# EAGLE design myStravaB_V3 (EAGLE 9.6.2)

## Sheet 1 of 5: MCU
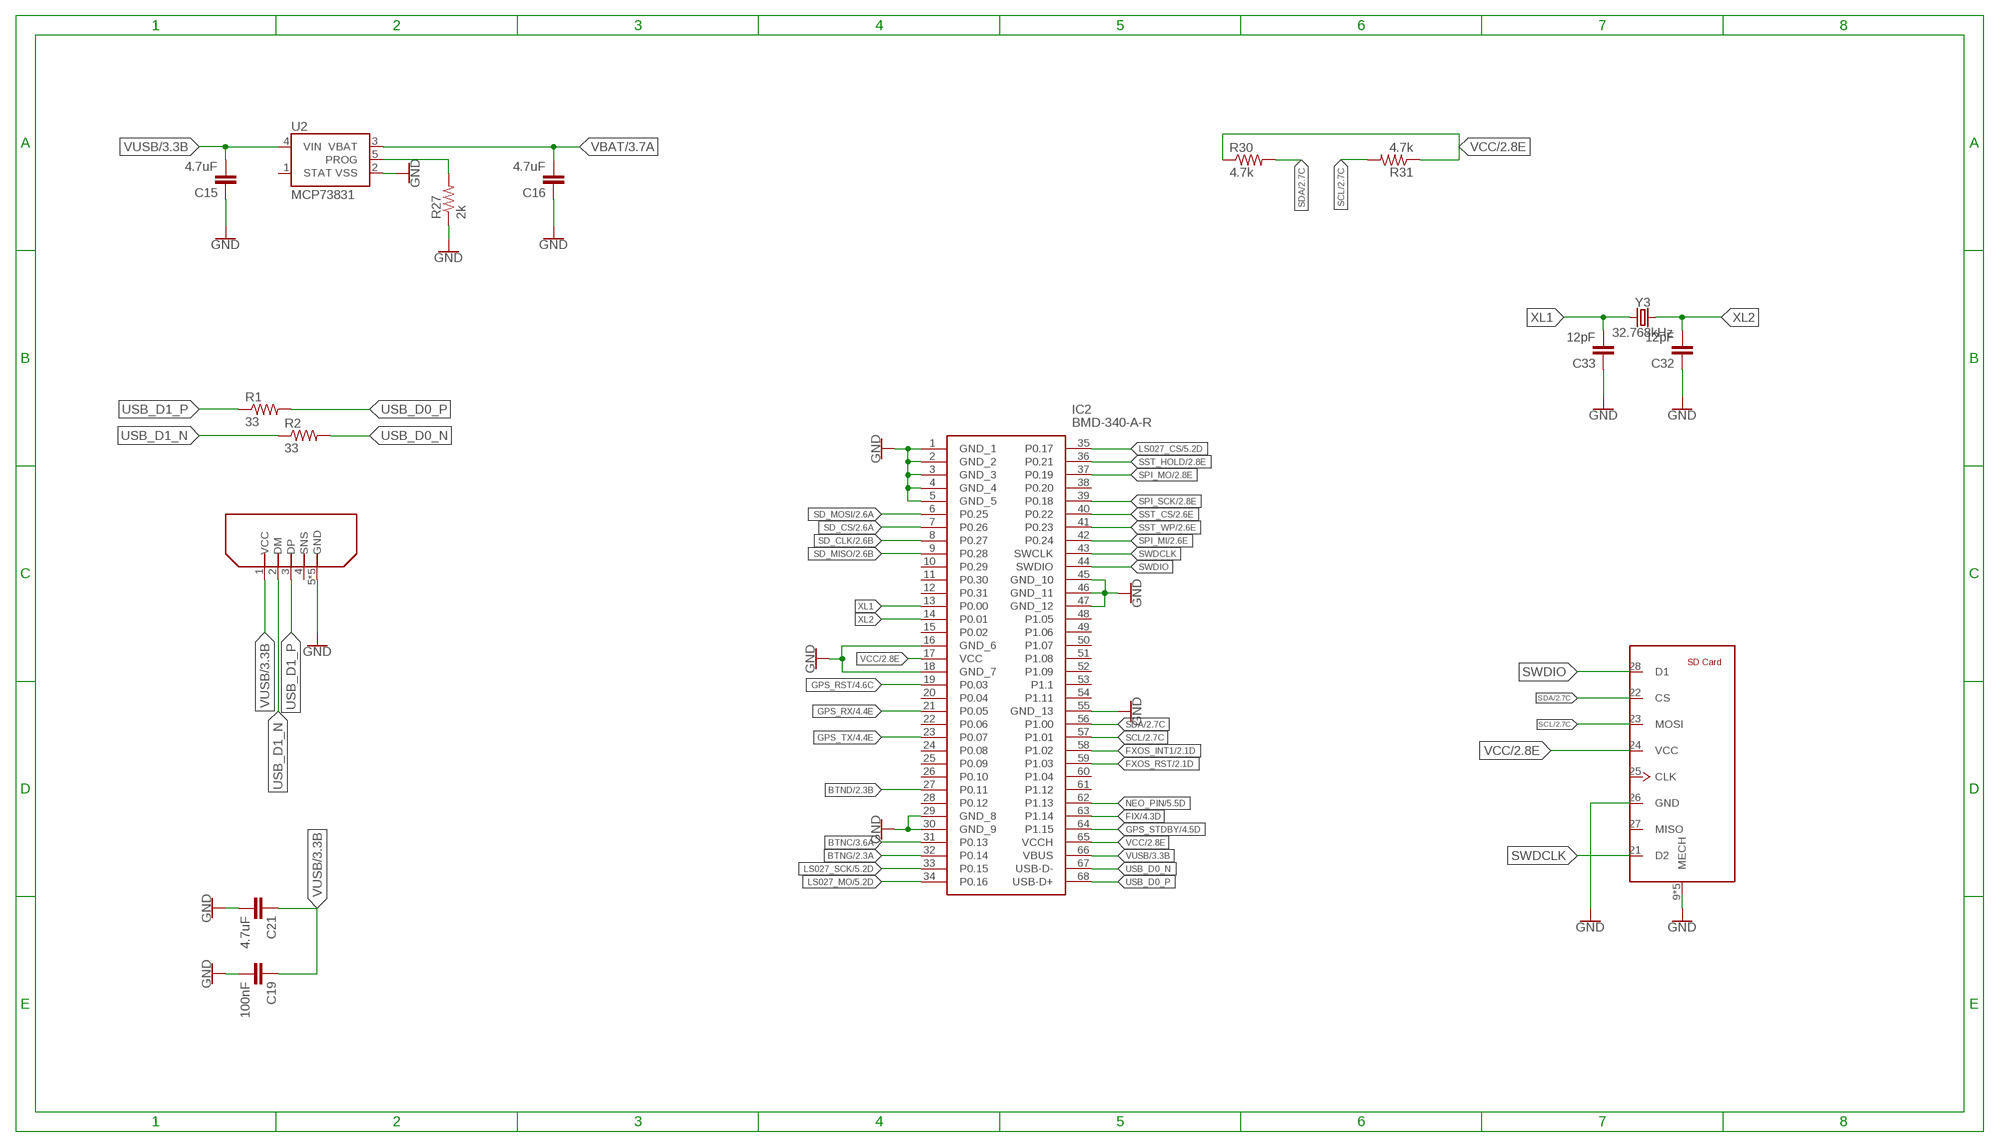
[diagram p0: schematic, sheet 1]

### Parts
C15  4.7uF  C-EUC0805  [C0805]
C16  4.7uF  C-EUC0805  [C0805]
C19  100nF  C-EUC0603  [C0603]
C21  4.7uF  C-EUC0805  [C0805]
C32  12pF  C-EUC0603  [C0603]
C33  12pF  C-EUC0603  [C0603]
IC2  BMD-340-A-R  [BMD340AR]
J1  47571-0001  [47571-0001]
R1  33  R-US_R0603  [R0603]
R2  33  R-US_R0603  [R0603]
R27  2k  R-US_R0603  [R0603]
R30  4.7k  R-US_R0603  [R0603]
R31  4.7k  R-US_R0603  [R0603]
U2  MCP73831  [SOT23-5]
U$3  ZX80B5P  [ZX80B5P]
Y3  32.768kHz  CRYSTAL-32.768KHZSMD-3.2X1.5  [CRYSTAL-SMD-3.2X1.5MM]

### Nets
BTNC: IC2.31(P0.13) ; also sheet 3
BTND: IC2.27(P0.11) ; also sheet 2
BTNG: IC2.32(P0.14) ; also sheet 2
FIX: IC2.63(P1.14) ; also sheet 4
FXOS_INT1: IC2.58(P1.02) ; also sheet 2
FXOS_RST: IC2.59(P1.03) ; also sheet 2
GND [power]: C15.1 C16.1 C19.2 C21.2 C32.1 C33.1 IC2.1(GND_1) IC2.2(GND_2) IC2.3(GND_3) IC2.4(GND_4) IC2.5(GND_5) IC2.16(GND_6) IC2.18(GND_7) IC2.29(GND_8) IC2.30(GND_9) IC2.45(GND_10) IC2.46(GND_11) IC2.47(GND_12) IC2.55(GND_13) J1.9(MECH) J1.10(MECH) J1.11(MECH) J1.12(MECH) J1.13(MECH) J1.26(GND) R27.1 U2.2(VSS) U$3.5(GND) U$3.GND1(GND) U$3.GND2(GND) U$3.GND3(GND) U$3.GND4(GND) ; also sheet 2,3,4,5
GPS_RST: IC2.19(P0.03) ; also sheet 4
GPS_RX: IC2.21(P0.05) ; also sheet 4
GPS_STDBY: IC2.64(P1.15) ; also sheet 4
GPS_TX: IC2.23(P0.07) ; also sheet 4
LS027_CS: IC2.35(P0.17) ; also sheet 5
LS027_MO: IC2.34(P0.16) ; also sheet 5
LS027_SCK: IC2.33(P0.15) ; also sheet 5
N$13: R27.2 U2.5(PROG)
NEO_PIN: IC2.62(P1.13) ; also sheet 5
SCL: IC2.57(P1.01) J1.23(MOSI) R31.2 ; also sheet 2,3,5
SD_CLK: IC2.8(P0.27) ; also sheet 2
SD_CS: IC2.7(P0.26) ; also sheet 2
SD_MISO: IC2.9(P0.28) ; also sheet 2
SD_MOSI: IC2.6(P0.25) ; also sheet 2
SDA: IC2.56(P1.00) J1.22(CS) R30.2 ; also sheet 2,3,5
SPI_MI: IC2.42(P0.24) ; also sheet 2
SPI_MO: IC2.37(P0.19) ; also sheet 2
SPI_SCK: IC2.39(P0.18) ; also sheet 2
SST_CS: IC2.40(P0.22) ; also sheet 2
SST_HOLD: IC2.36(P0.21) ; also sheet 2
SST_WP: IC2.41(P0.23) ; also sheet 2
SWDCLK: IC2.43(SWCLK) J1.21(D2)
SWDIO: IC2.44(SWDIO) J1.28(D1)
USB_D0_N [usb]: IC2.67(USB-D-) R2.2
USB_D0_P [usb]: IC2.68(USB-D+) R1.2
USB_D1_N [usb]: R2.1 U$3.2(DM)
USB_D1_P [usb]: R1.1 U$3.3(DP)
VBAT [power]: C16.2 U2.3(VBAT) ; also sheet 3,4
VCC [power]: IC2.17(VCC) IC2.65(VCCH) J1.24(VCC) R30.1 R31.1 ; also sheet 2,3,4,5
VUSB [power]: C15.2 C19.1 C21.1 IC2.66(VBUS) U2.4(VIN) U$3.1(VCC) ; also sheet 3
XL1: C33.2 IC2.13(P0.00) Y3.P$1
XL2: C32.2 IC2.14(P0.01) Y3.P$2
Unconnected: IC2.10(P0.29) IC2.11(P0.30) IC2.12(P0.31) IC2.15(P0.02) IC2.20(P0.04) IC2.22(P0.06) IC2.24(P0.08) IC2.25(P0.09) IC2.26(P0.10) IC2.28(P0.12) IC2.38(P0.20) IC2.48(P1.05) IC2.49(P1.06) IC2.50(P1.07) IC2.51(P1.08) IC2.52(P1.09) IC2.53(P1.1) IC2.54(P1.11) IC2.60(P1.04) IC2.61(P1.12) J1.25(CLK) J1.27(MISO) U2.1(STAT) U$3.4(SNS)

## Sheet 2 of 5: Memory
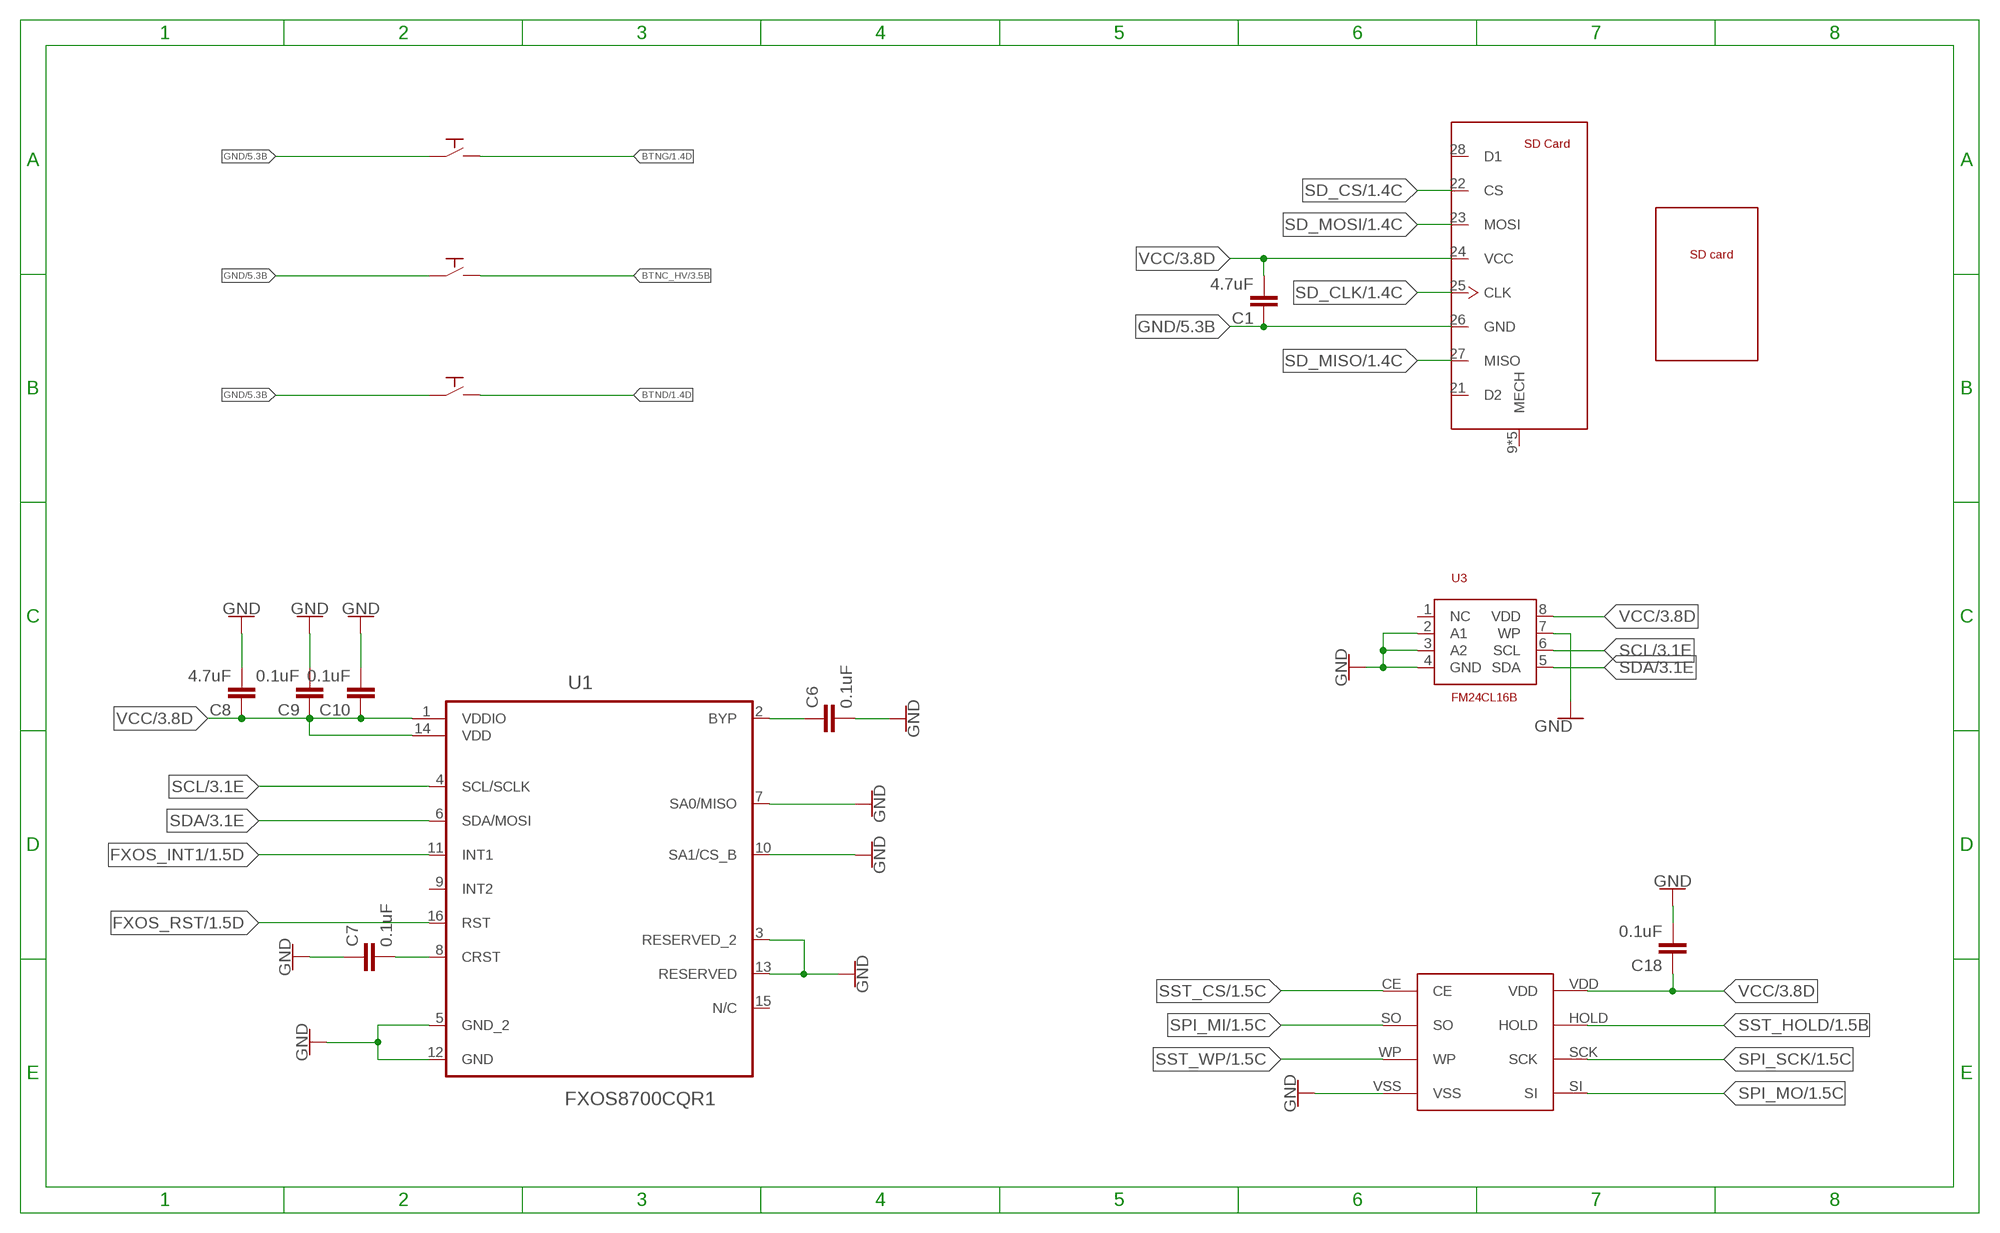
[diagram p1: schematic, sheet 2]

### Parts
B1  MICRO-SD_FOOTPRINT  [MICRO-SD-FOOTPRINT]
C1  4.7uF  4.7UF0603  [0603]
C6  0.1uF  4.7UF0603  [0603]
C7  0.1uF  4.7UF0603  [0603]
C8  4.7uF  4.7UF0603  [0603]
C9  0.1uF  4.7UF0603  [0603]
C10  0.1uF  4.7UF0603  [0603]
C18  0.1uF  4.7UF0603  [0603]
SD  47571-0001  [47571-0001]
SPST1  PTS526SK08  [PTS526SKG15SMTR2LFS]
SPST2  PTS526SK08  [PTS526SKG15SMTR2LFS]
SPST3  PTS526SK08  [PTS526SKG15SMTR2LFS]
U1  FXOS8700CQR1  [QFN50P300X300X120-16N]
U3  FM24CL16B  TWI_FRAM  [SOIC127P600X175-8N]
U$2  FLASH  [SOIC8]

### Nets
BTNC_HV: SPST2.3 SPST2.4 ; also sheet 3
BTND: SPST3.3 SPST3.4 ; also sheet 1
BTNG: SPST1.3 SPST1.4 ; also sheet 1
BYP: C6.1 U1.2(BYP)
CRST: C7.2 U1.8(CRST)
FXOS_INT1: U1.11(INT1) ; also sheet 1
FXOS_RST: U1.16(RST) ; also sheet 1
GND [power]: C1.1 C6.2 C7.1 C8.2 C9.2 C10.2 C18.2 SD.26(GND) SPST1.1 SPST1.2 SPST2.1 SPST2.2 SPST3.1 SPST3.2 U1.3(RESERVED_2) U1.5(GND_2) U1.7(SA0/MISO) U1.10(SA1/CS_B) U1.12(GND) U1.13(RESERVED) U3.2(A1) U3.3(A2) U3.4(GND) U3.7(WP) U$2.VSS ; also sheet 1,3,4,5
SCL: U1.4(SCL/SCLK) U3.6(SCL) ; also sheet 1,3,5
SD_CLK: SD.25(CLK) ; also sheet 1
SD_CS: SD.22(CS) ; also sheet 1
SD_MISO: SD.27(MISO) ; also sheet 1
SD_MOSI: SD.23(MOSI) ; also sheet 1
SDA: U1.6(SDA/MOSI) U3.5(SDA) ; also sheet 1,3,5
SPI_MI: U$2.SO ; also sheet 1
SPI_MO: U$2.SI ; also sheet 1
SPI_SCK: U$2.SCK ; also sheet 1
SST_CS: U$2.CE ; also sheet 1
SST_HOLD: U$2.HOLD ; also sheet 1
SST_WP: U$2.WP ; also sheet 1
VCC [power]: C1.2 C8.1 C9.1 C10.1 C18.1 SD.24(VCC) U1.1(VDDIO) U1.14(VDD) U3.8(VDD) U$2.VDD ; also sheet 1,3,4,5
Unconnected: SD.9(MECH) SD.10(MECH) SD.11(MECH) SD.12(MECH) SD.13(MECH) SD.21(D2) SD.28(D1) U1.9(INT2) U1.15(N/C) U3.1(NC)

## Sheet 3 of 5: Power
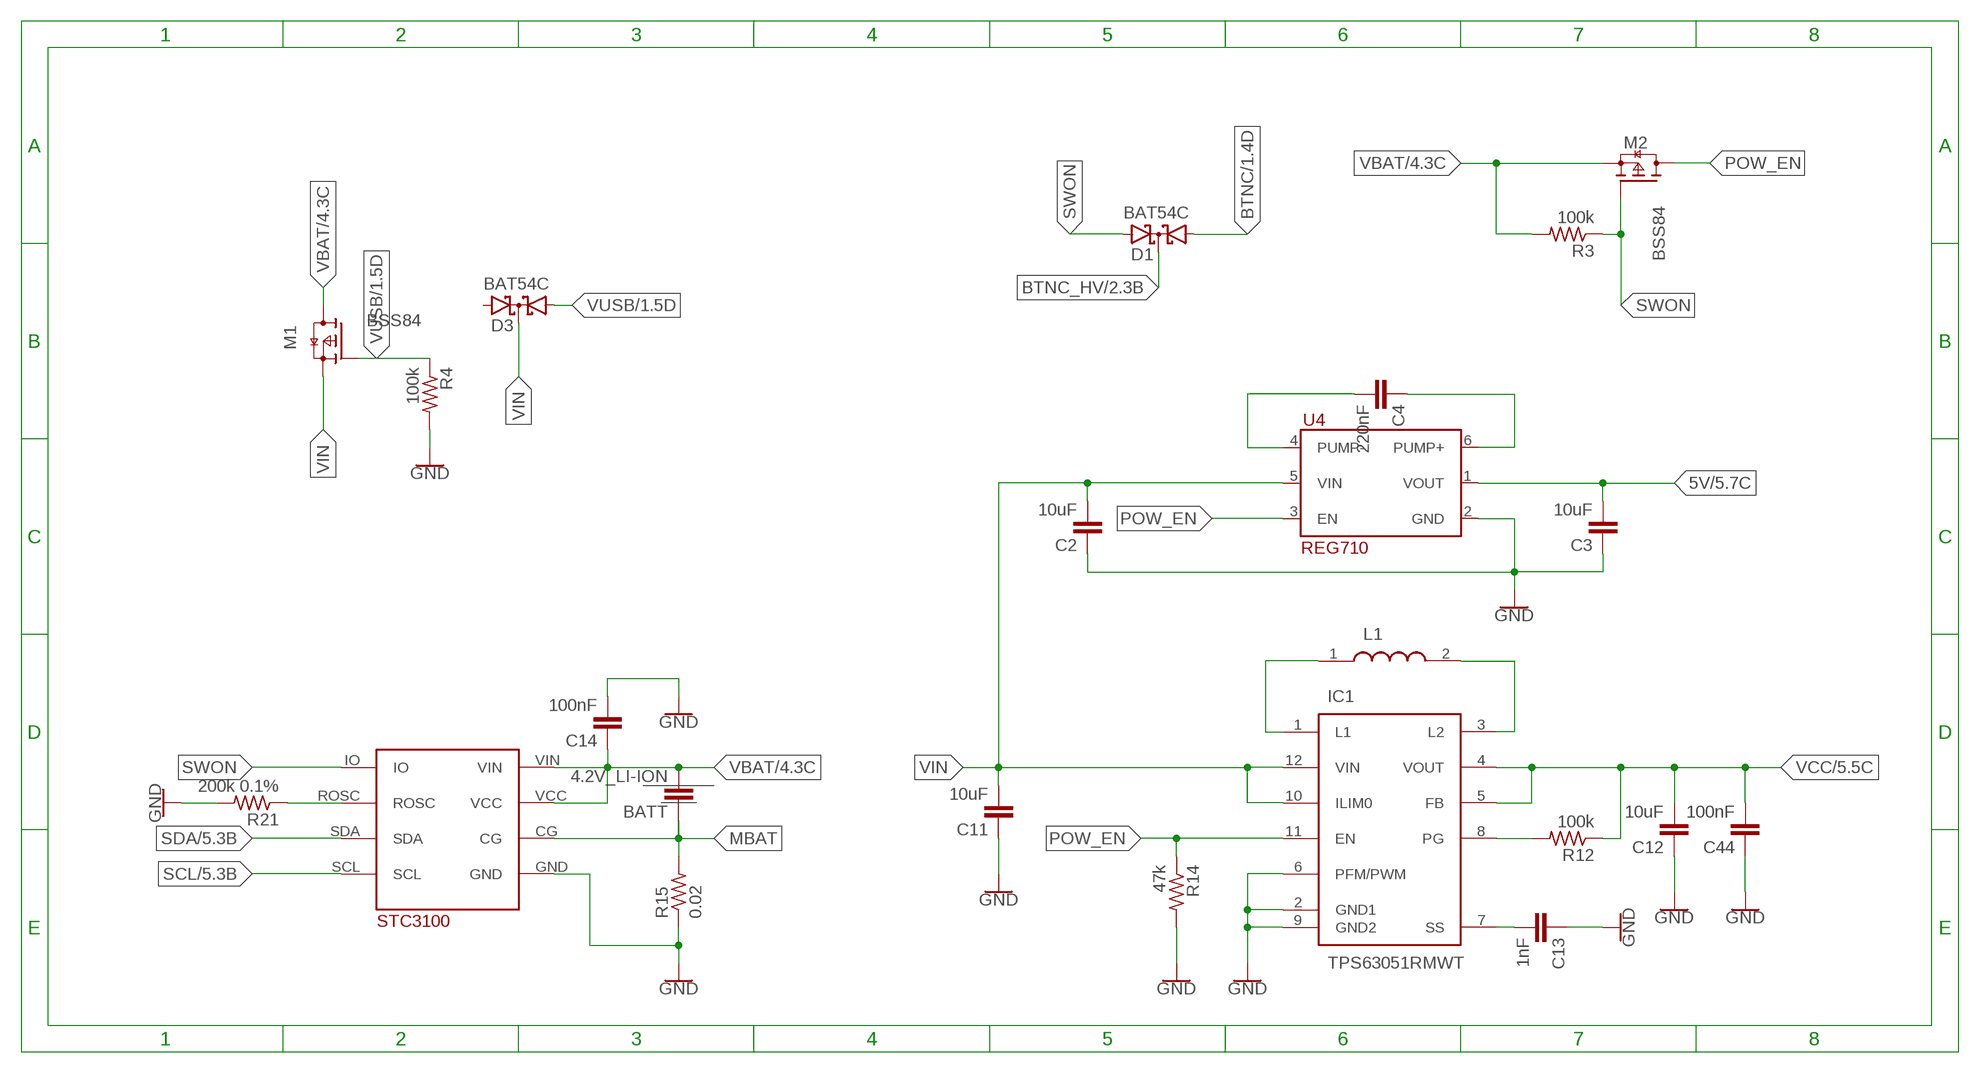
[diagram p2: schematic, sheet 3]

### Parts
BATT  4.2V_LI-ION  C-EUC1210  [C1210]
C2  10uF  C-EUC0805  [C0805]
C3  10uF  C-EUC0805  [C0805]
C4  220nF  C-EUC0805  [C0805]
C11  10uF  C-EUC0805  [C0805]
C12  10uF  C-EUC0603  [C0603]
C13  1nF  C-EUC0603  [C0603]
C14  100nF  C-EUC0603  [C0603]
C44  100nF  C-EUC0603  [C0603]
D1  BAT54C  [SOT23]
D3  BAT54C  [SOT23]
IC1  TPS63051RMWT  [QFN50P250X250X100-12N]
L1  1269AS-H-1R5M=P2  [INDC2520X110N]
M1  BSS84  GEN_NCH  [SOT65P210X110-3N]
M2  BSS84  GEN_NCH  [SOT65P210X110-3N]
R3  100k  R-US_R0603  [R0603]
R4  100k  R-US_R0603  [R0603]
R12  100k  R-US_R0603  [R0603]
R14  47k  R-US_R0603  [R0603]
R15  0.02  R-US_R0603  [R0603]
R21  200k 0.1%  R-US_R0603  [R0603]
U4  REG710  [SOT457]
U$6  STC3100  [STC3100]

### Nets
5V: C3.2 U4.1(VOUT) ; also sheet 5
BTNC: D1.1(A1) ; also sheet 1
BTNC_HV: D1.3(CC) ; also sheet 2
GND [power]: C2.1 C3.1 C11.1 C12.1 C13.1 C14.2 C44.1 IC1.2(GND1) IC1.6(PFM/PWM) IC1.9(GND2) R4.2 R14.2 R15.1 R21.2 U4.2(GND) U$6.GND ; also sheet 1,2,4,5
L1: IC1.1(L1) L1.1
L2: IC1.3(L2) L1.2
MBAT: BATT.1 R15.2 U$6.CG
N$5: C4.1 U4.6(PUMP+)
N$6: C4.2 U4.4(PUMP-)
PG: IC1.8(PG) R12.2
POW_EN: IC1.11(EN) M2.3(D) R14.1 U4.3(EN)
ROSC: R21.1 U$6.ROSC
SCL: U$6.SCL ; also sheet 1,2,5
SDA: U$6.SDA ; also sheet 1,2,5
SS: C13.2 IC1.7(SS)
SWON [power]: D1.2(A2) M2.1(G) R3.1 U$6.IO
VBAT [power]: BATT.2 C14.1 M1.3(D) M2.2(S) R3.2 U$6.VCC U$6.VIN ; also sheet 1,4
VCC [power]: C12.2 C44.2 IC1.4(VOUT) IC1.5(FB) R12.1 ; also sheet 1,2,4,5
VIN: C2.2 C11.2 D3.3(CC) IC1.10(ILIM0) IC1.12(VIN) M1.2(S) U4.5(VIN)
VUSB [power]: D3.1(A1) M1.1(G) R4.1 ; also sheet 1
Unconnected: D3.2(A2)

## Sheet 4 of 5: GPS
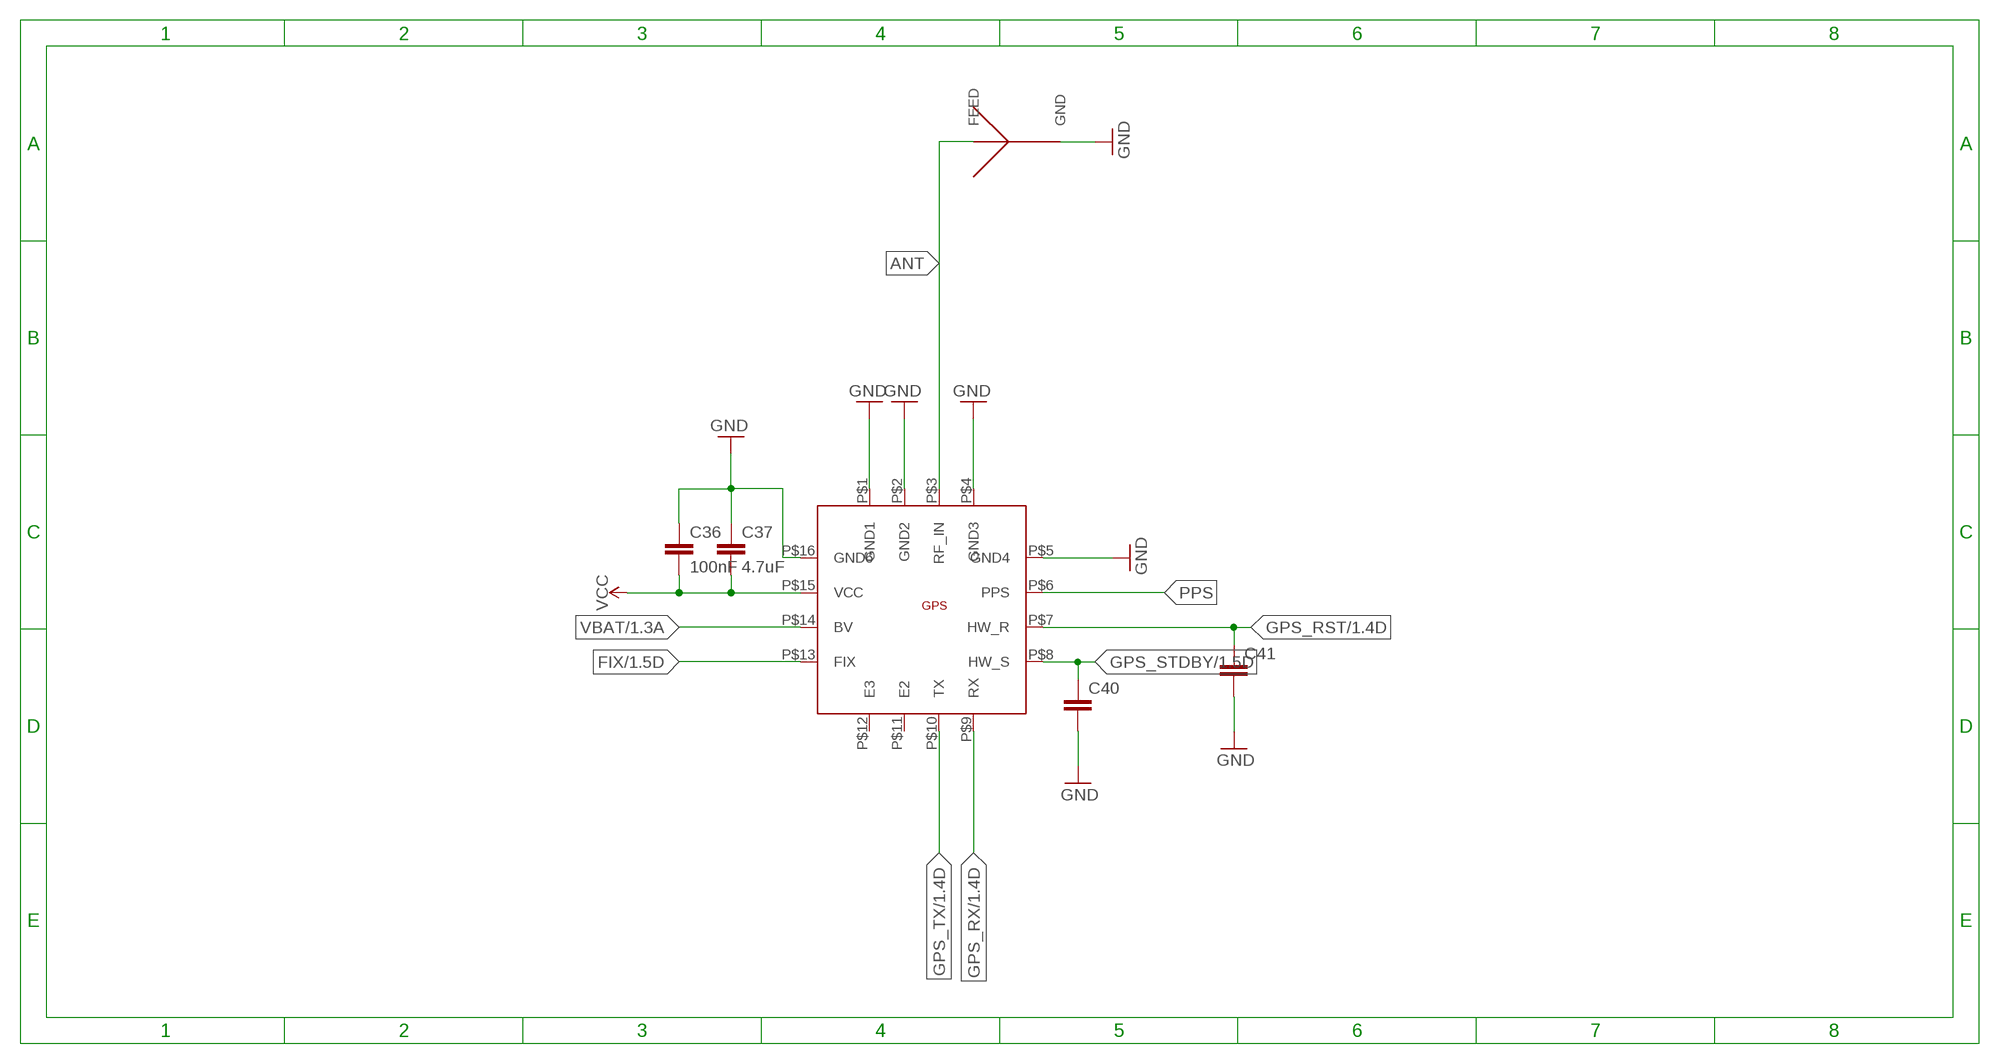
[diagram p3: schematic, sheet 4]

### Parts
C36  100nF  C-EUC0603  [C0603]
C37  4.7uF  C-EUC0603  [C0603]
C40  C-EUC0603  [C0603]
C41  C-EUC0603  [C0603]
U$4  SR4G008  [SR4G008]
U$5  M10578-A3  M10578  [M10578]

### Nets
ANT [RF]: U$4.P$2(FEED) U$5.P$3(RF_IN)
FIX: U$5.P$13(FIX) ; also sheet 1
GND [power]: C36.1 C37.1 C40.2 C41.2 U$4.P$3(GND) U$4.P$4(GND) U$4.P$6(GND) U$5.P$1(GND1) U$5.P$2(GND2) U$5.P$4(GND3) U$5.P$5(GND4) U$5.P$16(GND6) ; also sheet 1,2,3,5
GPS_RST: C41.1 U$5.P$7(HW_R) ; also sheet 1
GPS_RX: U$5.P$9(RX) ; also sheet 1
GPS_STDBY: C40.1 U$5.P$8(HW_S) ; also sheet 1
GPS_TX: U$5.P$10(TX) ; also sheet 1
PPS: U$5.P$6(PPS)
VBAT [power]: U$5.P$14(BV) ; also sheet 1,3
VCC [power]: C36.2 C37.2 U$5.P$15(VCC) ; also sheet 1,2,3,5
Unconnected: U$5.P$11(E2) U$5.P$12(E3)

## Sheet 5 of 5: Sensors
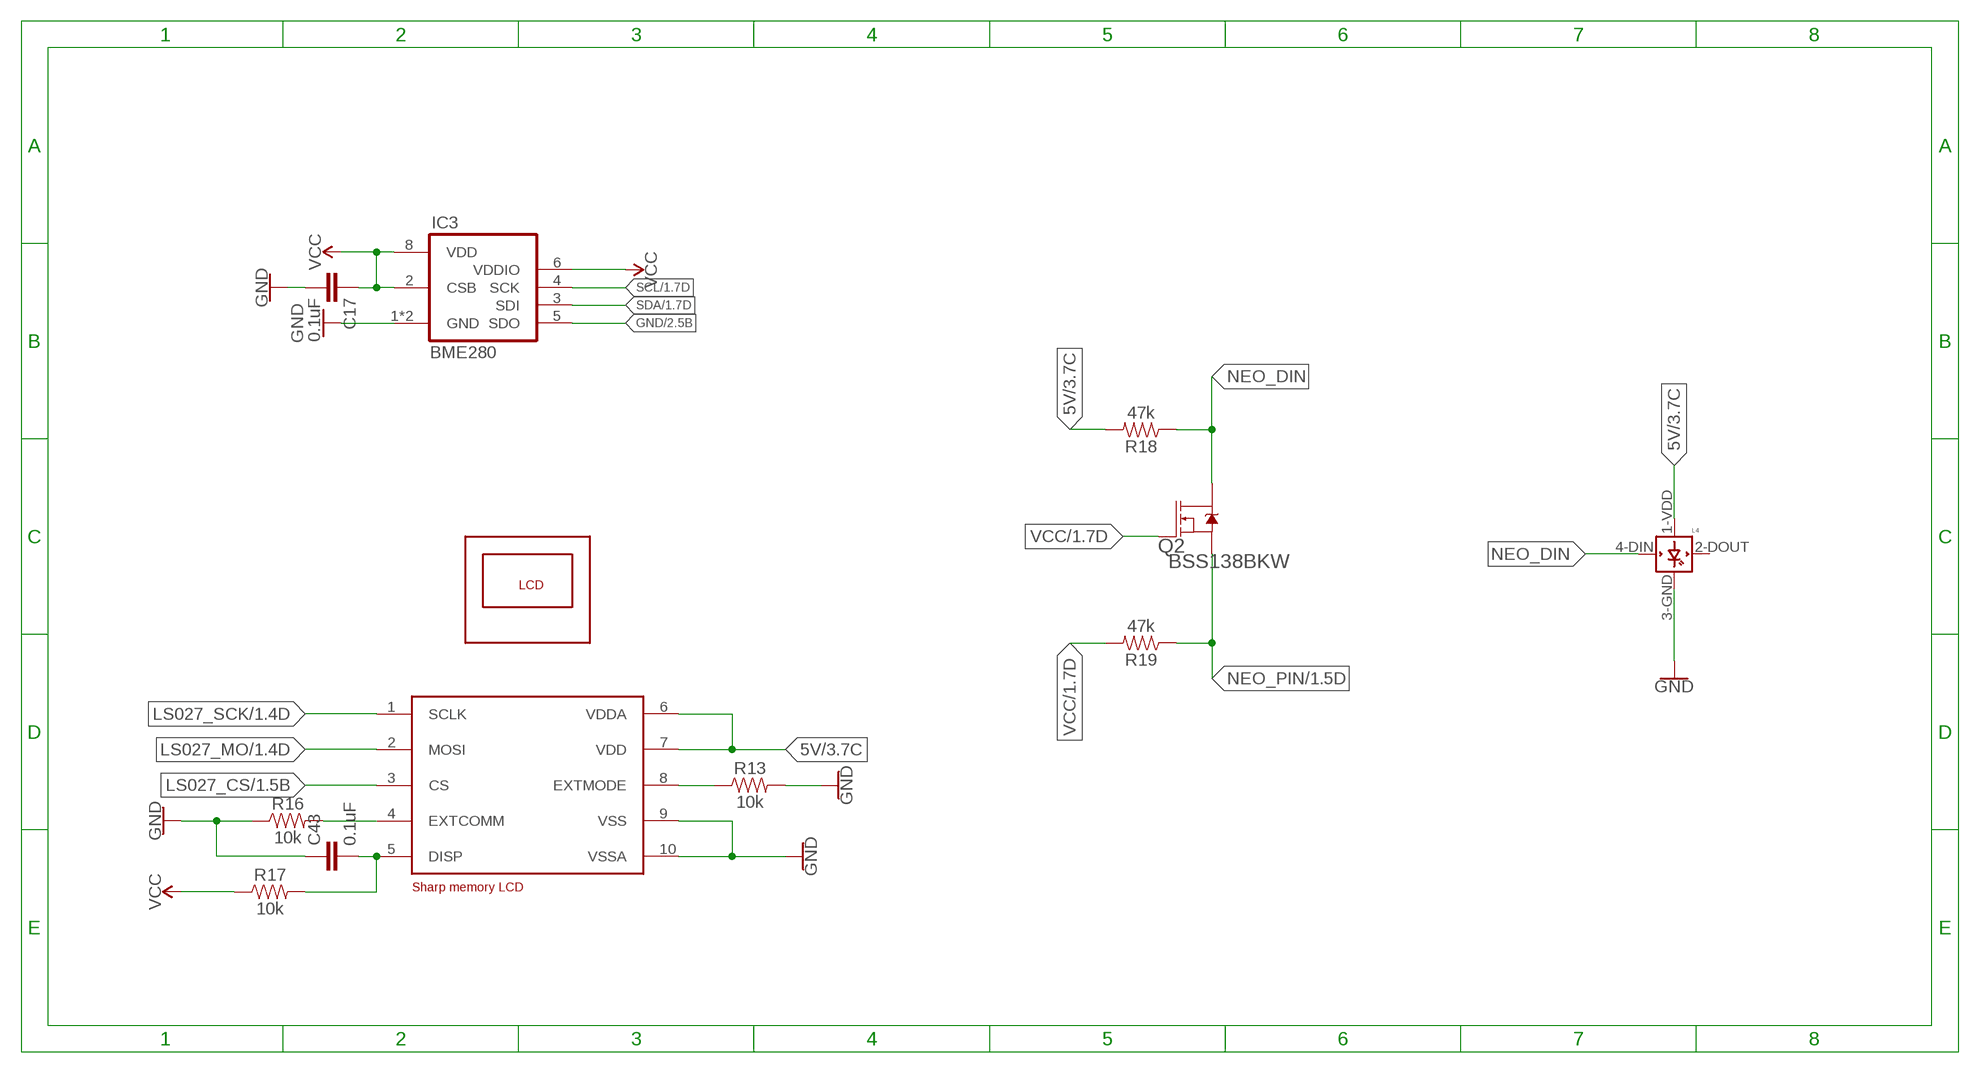
[diagram p4: schematic, sheet 5]

### Parts
C17  0.1uF  0.1UF-0603-25V-(+80/-20%)  [0603]
C43  0.1uF  0.1UF-0603-25V-(+80/-20%)  [0603]
IC3  BME280  [BME280]
L4  WS2812B  [WS2812B]
Q2  BSS138BKW  [SOT65P210X110-3N]
R13  10k  4.7KOHM-0603-1/10W-1%  [0603]
R16  10k  4.7KOHM-0603-1/10W-1%  [0603]
R17  10k  4.7KOHM-0603-1/10W-1%  [0603]
R18  47k  4.7KOHM-0603-1/10W-1%  [0603]
R19  47k  4.7KOHM-0603-1/10W-1%  [0603]
U$15  SHARP27_FOOTPRINT  [LCD27]
U$16  SHARP27  [SHARP27]

### Nets
5V: L4.1-VDD(VDD) R18.2 U$16.6(VDDA) U$16.7(VDD) ; also sheet 3
DISP1: C43.2 R17.2 U$16.5(DISP)
EXTCOMM1: R16.2 U$16.4(EXTCOMM)
EXTMODE1: R13.1 U$16.8(EXTMODE)
GND [power]: C17.2 C43.1 IC3.1(GND) IC3.5(SDO) IC3.7(GND) L4.3-GND(GND) R13.2 R16.1 U$16.9(VSS) U$16.10(VSSA) ; also sheet 1,2,3,4
LS027_CS: U$16.3(CS) ; also sheet 1
LS027_MO: U$16.2(MOSI) ; also sheet 1
LS027_SCK: U$16.1(SCLK) ; also sheet 1
NEO_DIN: L4.4-DIN(DIN) Q2.3(D) R18.1
NEO_PIN: Q2.2(S) R19.1 ; also sheet 1
SCL: IC3.4(SCK) ; also sheet 1,2,3
SDA: IC3.3(SDI) ; also sheet 1,2,3
VCC [power]: C17.1 IC3.2(CSB) IC3.6(VDDIO) IC3.8(VDD) Q2.1(G) R17.1 R19.2 ; also sheet 1,2,3,4
Unconnected: L4.2-DOUT(DOUT)

## Library data of the parts
B1 = SD_Card:MICRO-SD_FOOTPRINT: microSD Card Footprint This is the mechnical footprint with connections for soldering a microSD card - NOT for a socket for the card. SparkFun Products: MicroSD Card with Adapter - 8 GB <https://www.sparkfun.com/products/11609> SparkFun microSD Sniffer <https://www.sparkfun.com/products/9419>
BATT C2-C4 C11-C14 C19 C21 C36 C37 C40 C41 C44 = rcl:C-EU: CAPACITOR, European symbol; SPICEPREFIX: C
C1 C8 = SparkFun-Capacitors:4.7UF: 4.7µF ceramic capacitors A capacitor is a passive two-terminal electrical component used to store electrical energy temporarily in an electric field.; PROD_ID: CAP-08280
C6 C7 C9 C10 C18 = SparkFun-Capacitors:4.7UF: 4.7µF ceramic capacitors A capacitor is a passive two-terminal electrical component used to store electrical energy temporarily in an electric field.; PROD_ID: CAP-08280; VALUE: 4.7uF
C15 C16 C32 C33 = rcl:C-EU: CAPACITOR, European symbol
C17 C43 = SparkFun-Capacitors:0.1UF: 0.1µF ceramic capacitors A capacitor is a passive two-terminal electrical component used to store electrical energy temporarily in an electric field.; PROD_ID: CAP-00810
D1 D3 = diode:BAT54C: Schottky Diodes Source: Fairchild .. BAT54.pdf
IC1 = DCDC:TPS63051RMWT: Switching Voltage Regulators Tiny Single Ind Buck Boost Convter Source: Datasheet <http://www.ti.com/general/docs/lit/getliterature.tsp?genericPartNumber=TPS63051&&fileType=pdf>; ARROW_PART_NUMBER: TPS63051RMWT; ARROW_PRICE/STOCK: https://www.arrow.com/en/products/tps63051rmwt/texas-instruments; DESCRIPTION: Switching Voltage Regulators Tiny Single Ind Buck Boost Convter; HEIGHT: 1mm; MANUFACTURER_NAME: Texas Instruments; MANUFACTURER_PART_NUMBER: TPS63051RMWT; RS_PART_NUMBER: 1330763; RS_PRICE/STOCK: http://uk.rs-online.com/web/p/products/1330763
IC2 = SamacSys_Parts:BMD-340-A-R: Bluetooth Modules (802.15.1) BMD-340-A-R with nRF52840 processor Source: Datasheet <https://componentsearchengine.com/Datasheets/1/BMD-340-A-R.pdf>; DESCRIPTION: Bluetooth Modules (802.15.1) BMD-340-A-R with nRF52840 processor; HEIGHT: 4mm; MANUFACTURER_NAME: Rigado; MANUFACTURER_PART_NUMBER: BMD-340-A-R; MOUSER_PART_NUMBER: 377-BMD-340-A-R
IC3 = bosch-bme280:BME280: DIGITAL HUMIDITY, PRESSURE AND TEMPERATURE SENSOR * Digital interface I²C (up to 3.4 MHz) and SPI (3 and 4 wire, up to 10 MHz)* Supply voltage VDD main supply voltage range: 1.71 V to 3.6 V*VDDIO interface voltage range: 1.2 V to 3.6 V Operating range -40…+85 °C, 0…100 % rel. humidity, 300…1100 hPa The library has been designed by Richard Magdycz <https://www.facebook.com/groups/eaglecadsoftUK>
J1 SD = SD_Card:47571-0001: Memory Card Connectors ASSY FOR TFR HEADER HEADER W/DETECT PIN Source: Datasheet <http://www.mouser.com/ds/2/276/0475710001_MEMORY_CARD_SOCKET-170076.pdf>
L1 = SamacSys_Parts:1269AS-H-1R5M=P2: Fixed Inductors 1.5uH 108mOhms2.1A +/-20% 2.5x2.0x1.0mm Source: Datasheet <https://componentsearchengine.com/Datasheets/1/1269AS-H-1R5M=P2.pdf>; ARROW_PART_NUMBER: 1269AS-H-1R5M=P2; ARROW_PRICE/STOCK: https://www.arrow.com/en/products/1269as-h-1r5mp2/murata-manufacturing; DESCRIPTION: Fixed Inductors 1.5uH 108mOhms2.1A +/-20% 2.5x2.0x1.0mm; HEIGHT: 1.1mm; MANUFACTURER_NAME: Murata Electronics; MANUFACTURER_PART_NUMBER: 1269AS-H-1R5M=P2
L4 = adafruit:WS2812B
M1 M2 = MOSFET:GEN_NCH: This MOSFET is designed to minimize the on-state resistance (RDS(ON)) and yet maintain superior switching performance, making it ideal for high efficiency power management applications.
Q2 = BSS138:BSS138BKW: N-channel Trench MOSFET; MPN: BSS138BKW; OC_FARNELL: 2053836; OC_NEWARK: 61T7488; PACKAGE: SOT-23-3; SUPPLIER: NXP
R1-R4 R12 R14 R15 R21 R27 R30 R31 = rcl:R-US_: RESISTOR, American symbol; SPICEPREFIX: R
R13 R16-R19 = SparkFun-Resistors:4.7KOHM: 4.7kΩ resistor A resistor is a passive two-terminal electrical component that implements electrical resistance as a circuit element. Resistors act to reduce current flow, and, at the same time, act to lower voltage levels within circuits. - Wikipedia; PROD_ID: RES-07857; VALUE: 4.7k
SPST1-SPST3 = SPST:PTS526SK08: Interrupteurs de contact 50mA 12VDC, 5.2x5.2mm, 0.8mm H, 260gf, G leads, No ground pin, no actuator Button SPST; MTN: 611-PTS526SK08SMTR2L
U1 = FXOS8700CQR1:FXOS8700CQR1: ACCELEROMETER, MEMS, 6-AXIS, DIGITAL OUTPUT,QFN-16; MPN: FXOS8700CQR1; OC_FARNELL: Unknown; OC_NEWARK: 47W8598; PACKAGE: QFN-16; SUPPLIER: FREESCALE SEMICONDUCTOR
U2 = SparkFun-IC-Power:MCP73831: MCP73831T Li-Ion, Li-Pol Controller Miniature single cell, fully integrated Li-Ion, Li-polymer charge management controller Datasheet <http://ww1.microchip.com/downloads/en/DeviceDoc/20001984g.pdf> SparkFun Products: SparkFun ESP32 Thing <https://www.sparkfun.com/products/13907> SparkFun 9DoF Razor IMU M0 <https://www.sparkfun.com/products/14001>; PROD_ID: IC-09995
U3 = FRAM:TWI_FRAM: TWI FRAM SOIC8 chip Cypress CY15B004J-SXE family
U4 = DCDC:REG710: REG710xx Buck-Boost Charge Pump with up to 60-mA Output Current
U$2 = FlashMem:FLASH
U$3 = USB:ZX80B5P
U$4 = SR4G008:SR4G008: Antenna for 1559 – 1609 MHz, GNSS for embedded applications  Solution for all global public constellations: GPS, GLONASS, Beidou and GALILEO.  Maintains high performance on device: DFI (Designed For Integration)  Ultra flat compact design of only 0.4mm thickness.  Designed for SMD mounting  Supplied on Tape and Reel
U$5 = M10578:M10578: Simple drop in solution full GNSS receiver (GPS/GLONASS/GALILEO/BEIDOU) • MediaTek MT3333 flash chip • Ultra-small SMD package; 9.0 x 9.0 x 1.8mm • Low current consumption • AIC, Active Interference Cancellation • EASY - Internally generated orbit prediction for fast fix times.
U$6 = STC3100:STC3100: The STC3100 monitors the critical parameters of a single-cell Li-Ion battery (voltage, temperature and current) and includes hardware functions to implement a gas gauge for battery charge monitoring, based on a programmable 12- to 14-bit A/D converter. With a typical 30 milliOhms external sense resistor, the battery current can be up to 2.5 A and the accumulator system provides a capacity up to +/-7000 mAh with a resolution of 0.2 mAh. The device is programmable through the I2C interface.
U$15 = sharp:SHARP27_FOOTPRINT
U$16 = sharp:SHARP27: Sharp memory LCD LS027B7DH01
Y3 = Sparkfun-clocks:CRYSTAL-32.768KHZ: 32.768kHz Crystal Frequency: 32.768kHz Frequency Stability: ±20ppm Load Capacitance: 12.5pF (PTH-2X6 & SMD-3.2X1.5), 6pF (SMD-2X6) SparkFun Products: SparkFun BigTime Watch Kit <https://www.sparkfun.com/products/11734> SparkFun nRF52832 Breakout <https://www.sparkfun.com/products/13990> SparkFun Real Time Clock Module <https://www.sparkfun.com/products/12708>; PROD_ID: XTAL-13062

## Net classes
0 default: width 0.152 mm, drill 0.254 mm, clearance 0.178 mm
1 power: width 0.229 mm, drill 0.203 mm, clearance 0.152 mm to class 0, clearance 0.203 mm
2 RF: width 0.762 mm, drill 0.305 mm, clearance 0.152 mm to class 0, clearance 0.152 mm to class 1, clearance 0.152 mm
3 usb: width 0.305 mm, drill 0.305 mm, clearance 0.508 mm to class 0, clearance 0.152 mm to class 1, clearance 0.508 mm to class 2, clearance 0.152 mm

## Board
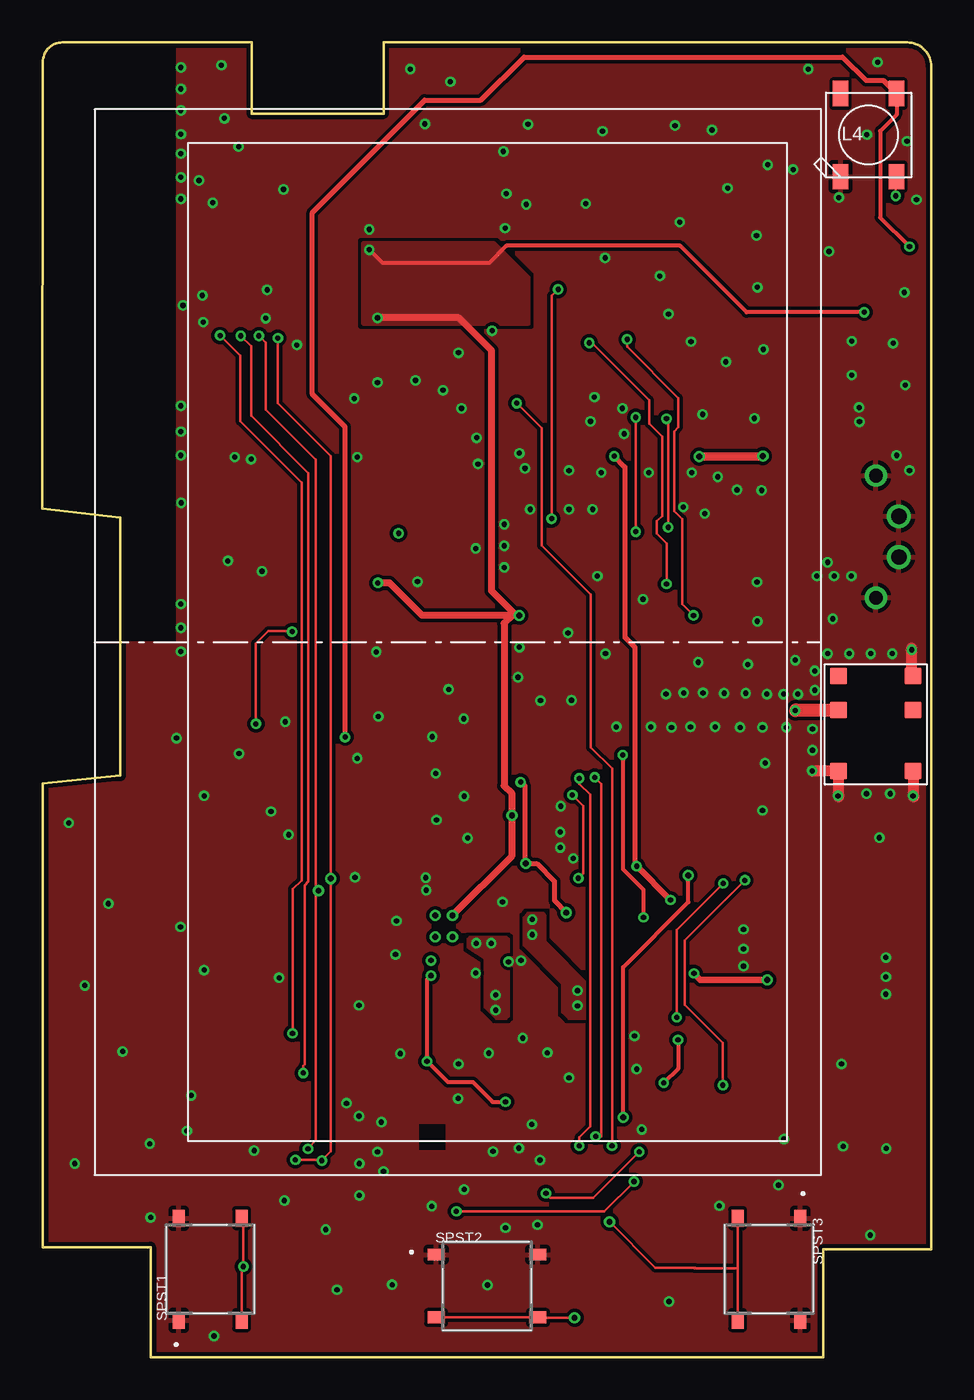
[diagram p5: board, top side]
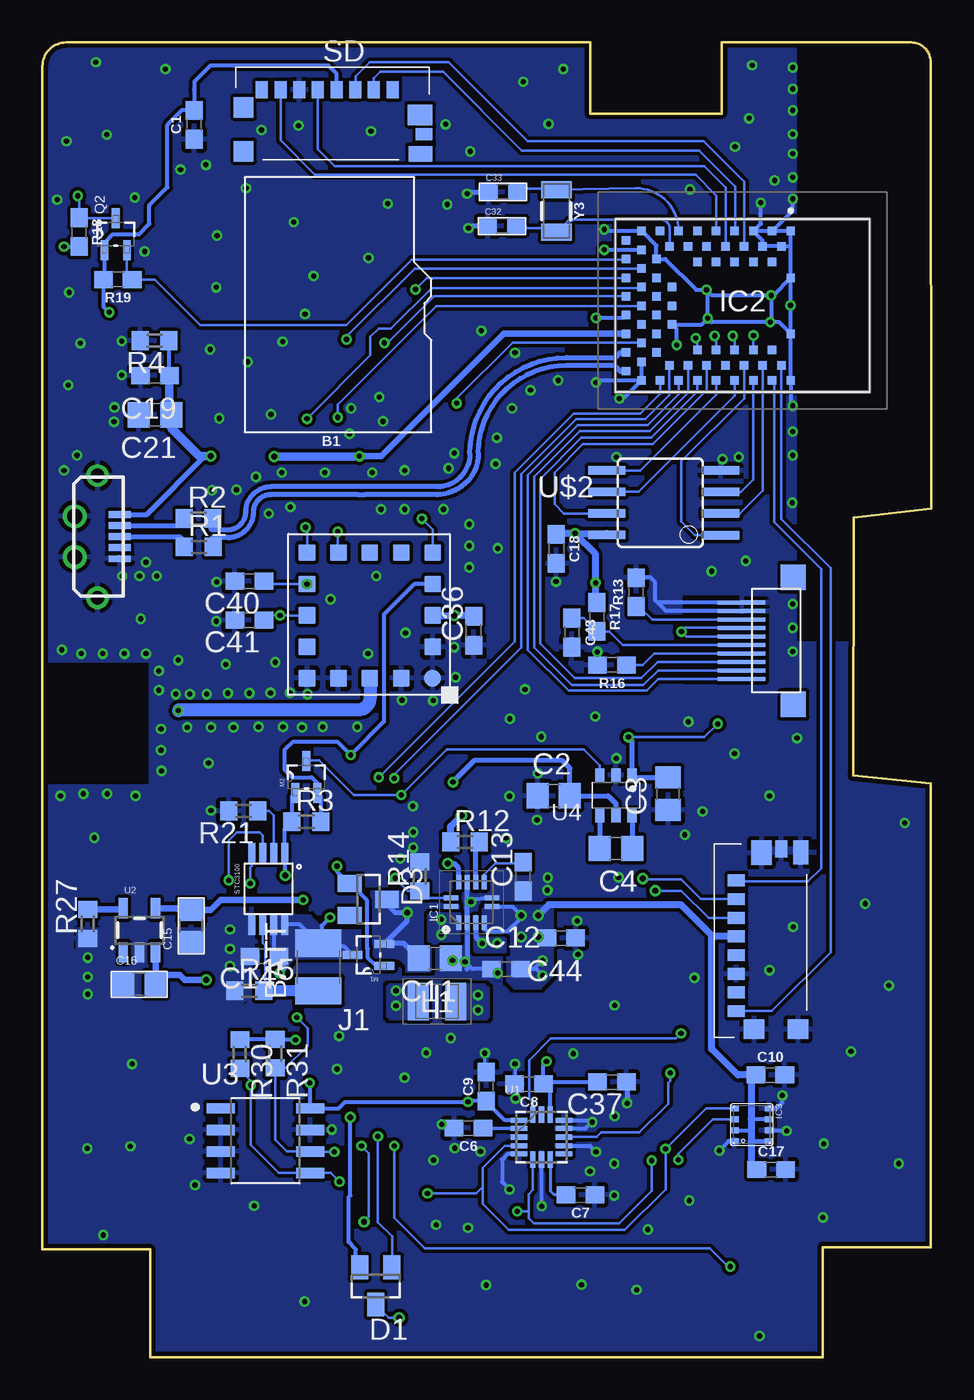
[diagram p6: board, bottom side, seen from below]

Size 52.35 x 77.47 mm. Coordinates in mm from the lower left corner, seen from the top.
Outline: 0.03,76.33 0,50.01 4.57,49.48 4.6,34.27 0.03,33.81 0.03,6.48 6.38,6.48 6.38,0 46,0 46,6.35 52.35,6.35 52.35,76.07 arc90 50.95,77.47 20.09,77.47 20.09,73.28 12.34,73.28 12.34,77.47 1.17,77.47 arc90 0.03,76.33
Copper layers (1*16): Top 0.035mm / dielectric 0.7mm / Bottom 0.035mm
Design rules "SeeedStudio_2layer_DRU_no_angle_20140221 *": minimum track width 6mil, minimum drill 12mil, track to track 6mil, track to pad 6mil, pad to pad 6mil, via to via 6mil, smd to smd 0mil, copper to edge 10mil, drill to drill 10mil, minimum pad ring 10mil, minimum via ring 6mil, stop-mask expansion 2mil, vias tented up to drill 100mil, thermal gap 10mil
tRestrict: area -0.7,42.2 to 7.8,78.3; area 46.1,33.8 to 52.1,40.8
bRestrict: area -0.6,42.2 to 7.9,78.3; area 46.1,33.8 to 52.1,40.9; area 3.4,56.7 to 18.8,67.3; area 11.3,39.6 to 14.6,44.9

### Footprints (pad centres in the part's own frame; a part is rotated, then mirrored left to right if it is on the bottom)
C1210 = smd 1.6 x 2.7: 1 -1.4,0; 2 1.4,0
0603 = smd 1.1 x 1: 1 -0.85,0; 2 0.85,0
C0805 = smd 1.3 x 1.5: 1 -0.95,0; 2 0.95,0
C0603 = smd 1.1 x 1: 1 -0.85,0; 2 0.85,0
SOT23 = smd 1 x 1.4: 1 -0.95,-1.1; 2 0.95,-1.1; 3 0,1.1
QFN50P250X250X100-12N = smd 0.85 x 0.3: 1 -1.2,0.75; 2 -1.2,0.25; 3 -1.2,-0.25; 4 -1.2,-0.75; 7 1.2,-0.75; 8 1.2,-0.25; 9 1.2,0.25; 10 1.2,0.75 | smd 0.3 x 0.85: 5 -0.25,-1.2; 6 0.25,-1.2; 11 0.25,1.2; 12 -0.25,1.2
BMD340AR = smd 0.5 x 0.5: 1 -8.8,-4.4; 2 -8.25,-3.5; 3 -7.7,-4.4; 4 -7.15,-3.5; 5 -6.6,-4.4; 6 -6.05,-3.5; 7 -5.5,-4.4; 8 -4.95,-3.5; 9 -4.4,-4.4; 10 -3.85,-3.5; 11 -3.3,-4.4; 12 -2.75,-3.5; 13 -2.2,-4.4; 14 -1.65,-3.5; 15 -1.1,-4.4; 16 0,-4.4; 17 0,-3.3; 18 -0.9,-2.75; 19 0,-2.2; 20 -0.9,-1.65; 21 0,-1.1; 22 -0.9,-0.55; 23 0,0; 24 -0.9,0.55; 25 0,1.1; 26 -0.9,1.65; 27 0,2.2; 28 -0.9,2.75; 29 0,3.3; 30 0,4.4; 31 -1.1,4.4; 32 -1.65,3.5; 33 -2.2,4.4; 34 -2.75,3.5; 35 -3.3,4.4; 36 -3.85,3.5; 37 -4.4,4.4; 38 -4.95,3.5; 39 -5.5,4.4; 40 -6.05,3.5; 41 -6.6,4.4; 42 -7.15,3.5; 43 -7.7,4.4; 44 -8.25,3.5; 45 -8.8,4.4; 46 -8.8,1.65; 47 -8.8,-1.65; 48 -7.7,-2.6; 49 -6.6,-2.6; 50 -5.5,-2.6; 51 -4.4,-2.6; 52 -3.3,-2.6; 53 -1.8,-1.1; 54 -1.8,0; 55 -1.8,1.1; 56 -3.3,2.6; 57 -4.4,2.6; 58 -5.5,2.6; 59 -6.6,2.6; 60 -7.7,2.6; 61 0.9,-3.85; 62 0.9,-2.75; 63 0.9,-1.65; 64 0.9,-0.55; 65 0.9,0.55; 66 0.9,1.65; 67 0.9,2.75; 68 0.9,3.85
BME280 = smd 0.35 x 0.5: 1 0.975,-1.025; 2 0.325,-1.025; 3 -0.325,-1.025; 4 -0.975,-1.025; 5 -0.975,1.025; 6 -0.325,1.025; 7 0.325,1.025; 8 0.975,1.025
47571-0001 = smd 1.15 x 1.2: 9 -5.225,0.365; 10 -5.225,-2.225 | smd 1.45 x 1.2: 11 5.175,-0.075 | smd 1 x 0.7: 12 5.4,-1.225 | smd 1.4 x 0.9: 13 5.2,-2.375 | smd 0.7 x 1: 21 3.55,1.415; 22 2.45,1.415; 23 1.35,1.415; 24 0.25,1.415; 25 -0.85,1.415; 26 -1.95,1.415; 27 -3.05,1.415; 28 -4.15,1.415
INDC2520X110N = smd 1.25 x 2.2: 1 -1.1,0; 2 1.1,0
WS2812B = smd 1.5 x 0.9: 1-VDD 2.45,-1.65; 2-DOUT 2.45,1.65; 3-GND -2.45,1.65; 4-DIN -2.45,-1.65
SOT65P210X110-3N = smd 1.168 x 0.457: 1 -0.94,0.65; 2 -0.94,-0.65; 3 0.94,0
SOT65P210X110-3N' = smd 1.168 x 0.457: 1 -0.94,0.66; 2 -0.94,-0.66; 3 0.94,0
R0603 = smd 1 x 1.1: 1 -0.85,0; 2 0.85,0
PTS526SKG15SMTR2LFS = smd 1 x 0.7: 1 -3,1.85; 2 3,1.85; 3 -3,-1.85; 4 3,-1.85
QFN50P300X300X120-16N = smd 0.965 x 0.305: 1 -1.321,0.991; 2 -1.321,0.508; 3 -1.321,0; 4 -1.321,-0.508; 5 -1.321,-0.991; 9 1.321,-0.991; 10 1.321,-0.508; 11 1.321,0; 12 1.321,0.508; 13 1.321,0.991 | smd 0.305 x 0.965: 6 -0.508,-1.321; 7 0,-1.321; 8 0.508,-1.321; 14 0.508,1.321; 15 0,1.321; 16 -0.508,1.321
SOT23-5 = smd 0.55 x 1.2: 1 -0.95,-1.3; 2 0,-1.3; 3 0.95,-1.3; 4 0.95,1.3; 5 -0.95,1.3
SOIC127P600X175-8N = smd 1.65 x 0.61: 1 -2.635,1.905; 2 -2.635,0.635; 3 -2.635,-0.635; 4 -2.635,-1.905; 5 2.635,-1.905; 6 2.635,-0.635; 7 2.635,0.635; 8 2.635,1.905
SOT457 = smd 0.55 x 0.8: 1 -0.95,-1.2; 2 0,-1.2; 3 0.95,-1.2; 4 0.95,1.2; 5 0,1.2; 6 -0.95,1.2
SOIC8 = smd 2.2 x 0.5: CE -3.554,1.905; HOLD 3.154,0.625; SCK 3.154,-0.645; SI 3.154,-1.905; SO -3.554,0.635; VDD 3.154,1.895; VSS -3.554,-1.905; WP -3.554,-0.635
ZX80B5P = smd 0.4 x 1.3: 1 -1.3,0; 2 -0.65,0; 3 0,0; 4 0.65,0; 5 1.3,0 | drill 0.8: GND1 3.6,-1.3; GND4 -3.6,-1.3 | drill 0.9: GND2 -1.2,-2.65; GND3 1.2,-2.65
SR4G008 = smd 1 x 1: P$1 0,0; P$2 2,0; P$3 5.6,0; P$4 5.6,4.4; P$5 2,4.4; P$6 0,4.4
M10578 = smd 1 x 1: P$1 0,0; P$2 1.85,0; P$3 3.7,0; P$4 5.55,0; P$5 7.4,0; P$6 7.4,-1.85; P$7 7.4,-3.7; P$8 7.4,-5.55; P$9 7.4,-7.4; P$10 5.55,-7.4; P$11 3.7,-7.4; P$12 1.85,-7.4; P$13 0,-7.4; P$14 0,-5.55; P$15 0,-3.7; P$16 0,-1.85
STC3100 = smd 1.213 x 0.406: CG 4.1,0.65; GND 4.1,0; IO -0.1,1.95; ROSC -0.1,1.3; SCL -0.1,0; SDA -0.1,0.65; VCC 4.1,1.3; VIN 4.1,1.95
SHARP27 = smd 2.8 x 0.25: 1 -2.62,-2.21; 2 -2.62,-1.71; 3 -2.62,-1.21; 4 -2.62,-0.71; 5 -2.62,-0.21; 6 -2.62,0.29; 7 -2.62,0.79; 8 -2.62,1.29; 9 -2.62,1.79; 10 -2.62,2.29 | smd 1.5 x 1.5: P$8 0.425,3.79; P$9 0.425,-3.71
CRYSTAL-SMD-3.2X1.5MM = smd 1 x 1.8: P$1 -1.25,0; P$2 1.25,0

### Placement (x,y rotation side)
B1  35.36,61.9 180 top
BATT  36.09,22.99 90 bottom
C1  43.41,72.62 90 bottom
C2  22.23,33.07 0 bottom
C3  15.49,33.2 90 bottom
C4  18.57,29.97 180 bottom
C6  27.25,13.49 180 bottom
C7  20.65,9.56 180 bottom
C8  23.69,16.1 180 bottom
C9  26.2,15.94 90 bottom
C10  9.47,16.62 0 bottom
C11  29.24,23.5 180 bottom
C12  25.04,22.86 0 bottom
C13  24.03,28.32 90 bottom
C14  39.27,23.62 180 bottom
C15  43.59,25.4 90 bottom
C16  46.63,21.97 0 bottom
C17  9.42,11.05 0 bottom
C18  22.07,47.62 270 bottom
C19  45.72,57.84 180 bottom
C21  45.72,55.52 180 bottom
C32  25.27,66.65 0 bottom
C33  25.22,68.66 0 bottom
C36  26.95,42.8 90 bottom
C37  18.8,16.21 180 bottom
C40  40.16,45.72 180 bottom
C41  40.16,43.43 180 bottom
C43  21.16,42.7 90 bottom
C44  21.79,24.69 180 bottom
D1  32.72,4.19 180 bottom
D3  33.15,26.97 270 bottom
IC1  27.08,26.8 90 bottom
IC2  17.07,61.95 180 bottom
IC3  10.57,13.69 270 bottom
J1  10.06,24.54 90 bottom
L1  29.11,20.96 0 bottom
L4  48.67,72.01 90 top
M1  33.15,23.7 180 bottom
M2  36.8,34.19 90 bottom
Q2  BSS138BKW  [SOT65P210X110-3N']  48.03,66.17 90 bottom
R1  43.13,47.74 0 bottom
R2  43.16,49.42 0 bottom
R3  36.8,31.55 0 bottom
R4  45.75,59.89 180 bottom
R12  27.46,30.35 0 bottom
R13  17.37,45.08 90 bottom
R14  30.12,28.32 90 bottom
R15  40.16,21.59 0 bottom
R16  18.8,40.79 0 bottom
R17  19.69,43.61 270 bottom
R18  50.19,66.29 270 bottom
R19  47.9,63.5 180 bottom
R21  40.51,32.18 180 bottom
R27  49.68,25.53 90 bottom
R30  40.72,17.86 270 bottom
R31  38.63,17.88 270 bottom
SD  35.27,73.28 0 bottom
SPST1  9.88,5.18 90 top
SPST2  26.19,4.19 0 top
SPST3  42.8,5.18 270 top
U1  22.95,12.96 0 bottom
U2  46.63,25.15 0 bottom
U3  39.22,12.75 0 bottom
U4  18.57,33.1 180 bottom
U$2  15.95,50.34 180 bottom
U$3  47.8,48.35 270 bottom
U$4  46.89,40.13 270 top
U$5  29.36,40.01 180 bottom
U$6  40.03,29.59 270 bottom
U$15  3.07,73.53 270 top
U$16  8.55,42.17 0 bottom
Y3  22.07,67.54 270 bottom

### Tracks (layer width: path | path; a pad name or v marks a point on that pad's centre or on a via)
5V  (via drill 0.3)
  Top 0.152: v12.57,37.31 12.57,42.04 13.31,42.77 14.68,42.77 v14.71,42.75
  Top 0.229: v51.08,65.43 49.35,67.16 49.35,72.25 50.32,73.21 L4.1-VDD
  Top 0.305: v17.83,36.54 17.83,54.81 15.9,56.74 15.9,67.45 22.52,74.07 25.83,74.07 28.37,76.61 47.14,76.61 48.51,75.23 49.54,75.23 L4.1-VDD
  Bottom 0.152: v17.83,36.54 13.35,36.54 v12.57,37.31 | U$16.7 11.18,42.98 14.48,42.98 v14.71,42.75 14.42,42.46 U$16.6 | U4.1 17.47,34.15
  Bottom 0.229: v51.08,65.43 50.2,65.43 R18.2
  Bottom 0.305: 17.47,34.15 C3.2 | U4.1 17.62,36.32 v17.83,36.54
ANT  (via drill 0.3)
  Top 0.762: U$4.P$2 44.38,38.13 v44.35,38.1
  Bottom 0.762: v44.35,38.1 44.31,38.14 33.77,38.14 arc-90 33.05,38.86 33.05,39.99 U$5.P$3
BTNC  (via drill 0.3)
  Top 0.152: v32.59,13.01 32.92,13.01 32.92,33.78 v32.54,34.16
  Bottom 0.152: IC2.31 15.97,56.76 17.13,55.6 21.05,55.6 24.54,52.12 24.54,42.16 v32.54,34.16 | D1.1 31.75,5.31 31.75,7.11 32.59,7.95 v32.59,13.01
BTNC_HV  (via drill 0.35)
  Top 0.152: SPST2.3 SPST2.4 29.22,2.31 v31.34,2.31
  Bottom 0.152: D1.3 31.94,2.31 v31.34,2.31
BTND  (via drill 0.3, 0.35)
  Top 0.152: v33.55,12.45 33.55,34.67 32.31,35.92 32.31,44.93 29.41,47.83 29.41,54.74 v27.94,56.21 | v33.41,7.97 36.11,5.27 38.45,5.27 38.41,5.23 40.94,5.23 40.95,5.23 | SPST3.3 40.95,5.23 | 40.95,5.23 SPST3.4
  Bottom 0.152: v33.55,12.45 33.12,12.01 33.12,8.26 v33.41,7.97 | v27.94,56.21 27.98,56.25 27.98,56.47 24.66,59.79 17.11,59.79 IC2.27
BTNG  (via drill 0.3)
  Top 0.152: v31.62,12.45 31.62,12.95 32.26,13.59 32.26,33.14 31.62,33.78 v31.62,34.11 | v11.84,5.33 11.68,5.18 | SPST1.4 11.84,8.08 v11.84,5.33 | SPST1.3 11.73,5.23 v11.84,5.33
  Bottom 0.152: v31.62,12.45 31.62,8.2 29.82,6.4 13.03,6.4 11.96,5.33 v11.84,5.33 | v31.62,34.11 31.62,34.33 24.16,41.8 24.16,52.03 20.92,55.27 16.84,55.27 15.42,56.69 IC2.32
BYP
  Bottom 0.203: U1.2 26.38,13.47 C6.1
CRST
  Bottom 0.178: C7.2 22.21,9.56 22.4,9.75 22.4,11.38 U1.8
DISP1
  Bottom 0.152: U$16.5 18.18,41.96 18.97,42.76 R17.2 20.47,43.55 C43.2
EXTCOMM1
  Bottom 0.152: U$16.4 16.31,41.46 16.98,40.79 R16.2
EXTMODE1
  Bottom 0.152: U$16.8 16.44,43.46 17.07,44.09 17.07,44.23 R13.1
FIX  (via drill 0.3)
  Top 0.152: v30.38,62.92 30,62.53 v30,49.4
  Bottom 0.152: U$5.P$13 29.36,48.77 v30,49.4 | v30.38,62.92 29.72,63.58 17.99,63.58 IC2.63
FXOS_INT1  (via drill 0.3)
  Top 0.152: v11.68,60.17 12.29,59.56 12.29,55.47 15.67,52.09 15.67,28.02 15.45,27.8 15.45,17.26 15.37,17.17 v15.37,16.74
  Bottom 0.152: U1.11 19.7,12.96 19.43,13.23 17.2,13.23 15.49,14.94 15.49,16.15 15.37,16.28 v15.37,16.74 | IC2.58 11.57,60.06 v11.68,60.17
FXOS_RST  (via drill 0.3)
  Top 0.152: v10.46,60.2 11.66,59 11.66,55.14 15.27,51.54 15.27,28.08 14.76,27.57 14.76,19.1 v14.73,19.08
  Bottom 0.152: U1.16 23.44,14.3 23.44,14.99 23.69,15.23 23.69,17.48 22.39,18.77 15.04,18.77 v14.73,19.08 | IC2.59 v10.47,60.19 v10.46,60.2
GND  (via drill 0.3)
  Top 0.635: 46.89,33.02 U$4.P$3 45.38,34.53 45.36,34.54 | U$4.P$4 v51.29,33.06 51.33,33.02 | U$4.P$6 51.21,40.21 51.21,41.78
  Bottom 0.203: IC1.2 | C9.2 26.29,16.87 v26.29,17.91 | v24.51,17.27 24.51,16.13 C8.2 | 22.95,8.91 v22.94,8.89
  Bottom 0.229: IC1.6 26.3,27.05 26.81,26.99 27.26,26.99 27.33,26.92 | 27.33,23.57 27.33,23.42 v27.46,23.29 | C12.1 27.03,22.86 v27.46,23.29 | C11.1 28.08,23.29 v27.46,23.29 | v19.25,66.45 19.16,66.35 IC2.16 17.02,66.35 16.18,65.51 16.18,64.71 IC2.18 15.65,64.7 13.84,62.89 v13.23,62.89 | v13.16,61.21 13.52,60.85 IC2.55 14.99,60.57 v14.99,59.64 | IC2.29 IC2.30 | IC2.30 19.61,57.55 v19.74,57.43 | IC2.30 18.13,56.49 v18.36,56.49 | IC2.47 9.31,62.56 v9.42,62.56 | IC2.46 8.95,60.98 v9.47,60.98 | IC2.46 IC2.45 8.27,56.17 v8.15,56.06 | IC2.47 8.27,65.46 | 8.27,65.46 IC2.1 IC2.3 | IC2.5 9.92,65.8 IC2.4 IC2.2 8.27,65.45 8.27,65.46 | IC2.5 10.03,66.79 v10.03,68.02 | IC2.3 8.15,67.57 v8.15,68.25 | IC2.3 IC2.5 | v9.42,62.56 12.9,62.56 v13.23,62.89 | v9.47,60.98 12.93,60.98 v13.16,61.21 | IC2.46 IC2.47 | v13.16,61.21 13.16,62.81 v13.23,62.89 | v9.42,62.56 9.42,61.04 v9.47,60.98 | U$16.9 15.62,43.96 | R13.2 16.52,45.93 16.26,45.67 16.26,44.6 16.12,44.46 | 15.64,43.99 16.12,44.46 | U$16.10 16.12,44.46 | U1.12 20.36,13.47 19.99,13.84 v19.96,13.84 20.08,13.96 U1.13 | IC3.5 9.08,14.67 8.76,14.99 v8.76,15.42 | IC3.7 8.54,13.37 v8.51,13.34 | IC3.1 11.92,12.72 v12.47,12.17 | U1.5 24.93,11.97 25.27,11.63 25.27,10.31 v24.84,9.88 | U1.10 20.1,12.46 v19.74,12.09 | U1.7 22.95,8.91
  Bottom 0.254: U$16.10 10.4,44.46 | U$16.9 11.67,43.96
  Bottom 0.305: IC1.9 IC1.2 27.33,26.92 | IC1.2 27.33,23.57 27.33,22.86 | v19.66,41.55 19.66,40.81 R16.1 | v27.33,68.56 27.23,68.66 C33.1 | C32.1 27.13,66.65 v27.25,66.52 | C37.1 17.91,16.17 v17.91,14.96
  other vias: 38.89,55.55 32.28,55.14 34.16,55.91 28.07,12.32 28.83,13.72 18.67,9.52 41.3,23.04 41.3,24.05 41.3,25.2 28.09,41.83 28.02,40.06 29.34,38.68 31.17,38.71 38.63,40.94 41.55,40.82 44.35,41.07 46.25,41.45 47.52,41.45 48.79,41.45 50.06,41.45 51.21,41.68 45.36,37.01 45.36,35.76 45.34,34.54 46.86,33.07 48.54,33.2 49.94,33.2 33.17,41.45 33.81,37.13 35.84,37.13 37.06,37.11 47.65,46.02 46.63,46.02 45.62,46.02 46.25,46.84 50.32,53.14 51.08,52.25 22.61,27.51 22.58,28.24 31.27,29.39 30.51,30.02 26.54,12.12 48.13,55.12 8.15,76 8.15,74.73 8.15,73.46 8.15,72.06 8.15,70.92 8.15,69.52 8.15,54.53 8.15,53.14 10.92,46.91 12.93,46.3 8.18,50.34 27.2,49.07 27.2,47.8 27.2,46.53 1.55,31.47 10.54,76.12 2.49,21.89 28.09,53.26 28.73,49.96 31.01,52.25 31.01,49.96 32.92,52.12 35.71,52.12 37.74,50.09 39.01,49.71 40.92,51.1 39.78,51.87 38.25,52.12 42.09,45.67 42.37,51.08 28.42,52.37 49.68,23.55 49.68,22.4 49.68,21.39 41.94,55.32 8.15,44.37 8.15,42.98 8.15,41.58 45.49,39.29 45.49,40.44 32.41,49.96 12.29,52.91 11.33,53.04 48.77,7.19 18.54,53.04 6.32,12.57 18.67,11.4 18.64,20.73 14.5,30.78 24.49,15.24 11.58,35.56 30.53,32.46 24.84,33.05 24.82,37.62 42.42,32.21 49.3,30.61 29.74,17.93 35,16.97 36.91,3.28 17.35,3.96 20.09,10.95 26.21,4.24 14.2,68.81 28.6,72.64 42.11,63.04 28.5,67.92 38.2,59.84 40.26,58.65 42.47,59.39 42.57,35 22.1,45.69 18.54,35.28 19.79,37.74 14.3,37.44 47.17,12.42 49.71,12.29 43.36,10.13 25.04,30.58 30.51,30.94 27.1,26.82 28.19,23.37 25.53,22.63 28.3,18.8 31.01,16.46 23.93,39.34 35.38,44.65 32.69,46.02 30.96,42.67 42.11,43.36 46.56,43.51 47.68,57.86 34.26,54.41 20.85,25.7 20.8,23.72 11.56,71.32 24.03,75.16 45.11,75.9 48.56,72.03 46.91,68.33 25.53,47.65 32.51,56.57 9.22,69.34 24.51,59.18 13.94,22.35 26.49,60.48 33.15,64.77 18.64,14.2 36.88,61.47 8.28,61.98 39.88,8.92 34.87,18.92 38.18,37.13 39.62,37.13 41.1,37.11 42.42,37.11 43.81,37.11 44.5,39.07 43.66,39.07 42.67,39.07 36.73,39.07 37.77,39.14 38.91,39.14 40.16,39.12 41.43,39.12 25.65,52.63 25.58,54.18 24.69,55.91 23.6,56.97 21.97,57.56 22.96,36.55 44.22,69.98 42.72,70.26 42.06,66.09 40.36,68.88 37.54,66.88 32,67.97 32.99,72.24 39.45,72.31 27.15,71.04 21.67,75.9 22.53,72.67 49.2,76.3 36.37,63.7 50.11,59.74 50.83,57.28 48.11,55.96 47.68,59.87 9.52,33.07 1.91,11.4 4.72,18.01 9.52,22.81 8.13,25.35 3.89,26.72 50.93,71.65 51.49,68.2 50.77,62.74 37.26,72.57 47.07,17.27 13.46,32.16 23.22,31.65 23.16,34.39 18.41,28.27 20.6,4.27 14.25,9.22 29.31,11.61 7.9,36.47 10.72,73 46.33,65.15 35.31,13.41 43.69,12.85 6.38,8.23 10.11,1.24 21.08,17.88 27.28,7.62 29.16,7.8 16.69,7.52
  pour Bottom (rank 3, no thermals): 22.76,30.1 31.27,30.1 31.78,29.59 31.78,22.35 31.52,22.1 25.17,22.23 25.17,23.62 26.57,23.62 26.7,23.75 26.7,26.92 22.5,26.92 22.5,29.84
  pour Bottom (no thermals): 50.32,20.83 40.54,20.83 40.28,21.08 40.28,22.86 39.9,23.24 39.9,25.91 40.16,26.16 41.55,26.16 42.44,25.27 50.32,25.27
  pour Top (rank 6): -9.5,93.09 67.97,93.09 67.97,-20.57 -9.5,-20.57
  pour Bottom (rank 6): -6.83,91.01 70.64,91.01 70.64,-22.66 -6.83,-22.66
GPS_RST  (via drill 0.3)
  Top 0.152: v34.44,59.97 34.44,59.54 37.47,56.52 37.47,54.8 37.21,54.54 37.21,49.87 37.69,49.39 37.69,44.37 v38.35,43.7
  Bottom 0.152: U$5.P$7 v38.35,43.7 39.04,43.7 C41.1 | v34.44,59.97 34.44,60.12 30.43,64.14 17.08,64.14 IC2.19
GPS_RX  (via drill 0.3)
  Top 0.152: v36.86,48.9 36.86,55.2
  Top 0.203: 36.86,55.2 v36.76,55.3
  Bottom 0.152: v36.76,55.3 33.03,59.03 33.03,60.12 32.55,60.6 31.82,60.6 29.41,63.01 17.11,63.01 IC2.21 | U$5.P$9 36.76,48.68 36.86,48.77
  Bottom 0.203: 36.86,48.77 v36.86,48.9
GPS_STDBY  (via drill 0.3)
  Top 0.152: v32.21,59.77 32.36,59.77 35.74,56.39 35.74,55.01 36.5,54.25 36.5,49.56 36.2,49.26 36.2,48.51 36.76,47.95 U$5.P$8
  Bottom 0.152: U$5.P$8 39.14,45.55 C40.1 | v32.21,59.77 32,59.77 29.26,62.51 IC2.64
  other vias: 36.76,45.55
GPS_TX  (via drill 0.3)
  Top 0.152: v34.95,48.64 v34.95,55.37
  Bottom 0.152: U$5.P$10 34.95,47.44 v34.95,48.64 | v34.95,55.37 34.95,56.13 29.16,61.92 18.18,61.92 17.74,61.92 17.1,61.92 IC2.23
L1  (via drill 0.3)
  other vias: 28.85,25.78 28.85,24.89 31.52,21.59 31.52,20.7
  pour Top (no thermals): 28.35,25.91 28.35,24.26 30.63,21.97 30.63,20.32 31.01,19.94 32.03,19.94 32.28,20.19 32.28,21.84 29.62,24.51 29.62,26.04 29.49,26.16 28.6,26.16
  pour Bottom (no thermals): 29.74,21.97 31.9,21.97 32.03,21.84 32.03,20.07 31.9,19.94 29.74,19.94
  pour Bottom (no thermals): 27.76,26.16 27.76,24.46 27.84,24.38 29.49,24.38 29.62,24.51 29.62,26.04 29.49,26.16
L2  (via drill 0.3)
  Bottom 0.305: 26.82,25.91 26.82,24.77 v26.44,24.38
  other vias: 25.55,24.38 26.7,21.34 26.7,20.45
  pour Top (no thermals): 25.04,24.13 25.04,24.64 25.17,24.77 27.33,24.77 27.46,24.64 27.46,20.07 27.33,19.94 26.72,19.94 26.06,20.6 26.06,23.5
  pour Bottom (no thermals): 26.06,21.72 26.31,21.97 28.35,21.97 28.47,21.84 28.47,19.94 26.19,19.94 26.06,20.07
  pour Bottom (no thermals): 25.04,23.88 25.04,24.64 25.17,24.77 26.57,24.77 26.7,24.89 26.7,25.91 26.95,25.91 26.95,24 26.82,23.88
LS027_CS
  Bottom 0.152: U$16.3 16.11,40.96 17.07,40.01 20.98,40.01 23.04,42.06 23.04,51.75 20.61,54.18 16.49,54.18 13.77,56.9 IC2.35
LS027_MO
  Bottom 0.152: U$16.2 16.09,40.46 16.95,39.6 21.16,39.6 23.37,41.81 23.37,51.89 20.7,54.56 16.58,54.56 14.32,56.82 IC2.34
LS027_SCK
  Bottom 0.152: U$16.1 16.06,39.96 16.76,39.27 21.35,39.27 23.75,41.67 23.75,51.97 20.81,54.91 16.69,54.91 14.87,56.74 IC2.33
MBAT
  Bottom 0.152: U$6.CG 39.38,24.4 39.24,24.26 39.24,21.66 R15.2
  Bottom 0.635: BATT.1 R15.2
N$5
  Bottom 0.305: U4.6 C4.1
N$6
  Bottom 0.305: U4.4 C4.2
N$13
  Bottom 0.381: R27.2 47.65,26.38 U2.5
NEO_DIN  (via drill 0.3)
  Top 0.152: v50.27,68.43 50.27,69.51 L4.4-DIN
  Bottom 0.152: Q2.3 50.15,67.11 R18.1 | 50.32,67.27 R18.1 | R18.1 50.19,68.35 v50.27,68.43
NEO_PIN
  Bottom 0.152: IC2.62 18.06,64.7 18.09,64.67 30.59,64.67 34.44,60.81 43.05,60.81 45.73,63.5 46.94,63.5 | R19.1 46.94,63.5 | Q2.2 47.37,63.93 46.94,63.5
PG
  Bottom 0.152: 26.83,30.19 R12.2
  Bottom 0.305: IC1.8 26.83,30.19
POW_EN  (via drill 0.3)
  Top 0.152: v31.57,28.22 31.85,28.5 31.85,32.49 v31.22,33.12
  Bottom 0.152: IC1.11 29.7,27.05 R14.1 30.82,27.47 v31.57,28.22 | M2.3 36.78,35.15 36.04,35.15 34.01,33.12 v31.22,33.12 28.52,35.81 20.47,35.81 19.52,34.86 U4.3
ROSC
  Bottom 0.152: U$6.ROSC 38.73,31.92 38.99,32.18 R21.1
SCL  (via drill 0.3, 0.35)
  Top 0.152: v12.75,60.17 13.16,59.77 13.16,55.82 16.1,52.87 16.1,27.33 | 16.1,27.33 16.1,12.77 15.65,12.31 v15.65,12.27 | v35.15,12.09 32.46,9.4 29.92,9.4 v29.67,9.65 | v40.11,27.91 37.36,25.17 v37.36,20.02 | v16.26,27.48 16.1,27.33
  Bottom 0.152: U1.4 25.11,12.46 26.42,11.15 26.42,10.03 | IC2.57 12.67,60.09 v12.75,60.17 | 26.42,10.03 26.42,9.04 24.87,7.49 18.03,7.49 15.65,9.88 v15.65,12.27 13.25,14.67 IC3.4 | v35.15,12.09 36.56,12.09 U3.6 37.95,12.12 38.63,12.8 R31.2 38.04,17.03 36.73,18.34 36.73,19.38 v37.36,20.02 | v29.67,9.65 26.8,9.65 26.42,10.03 | U$6.SCL 40.03,28.93 40.11,28.85 v40.11,27.91 | J1.23 13.11,25.89 14.71,27.48 v16.26,27.48
SD_CLK
  Bottom 0.152: IC2.8 12.1,65.47 12.1,68.92 13.36,70.18 35.12,70.18 36.12,71.17 SD.25
SD_CS
  Bottom 0.152: IC2.7 11.55,66.37 11.55,68.98 13.67,71.09 24.1,71.09 28.75,75.74 32.44,75.74 32.82,75.36 SD.22
SD_MISO
  Bottom 0.152: IC2.9 12.65,66.37 12.65,68.45 13.88,69.67 36.3,69.67 38.32,71.7 SD.27
SD_MOSI
  Bottom 0.152: IC2.6 11,65.47 11,69.27 13.39,71.65 23.77,71.65 28.42,76.3 33.06,76.3 33.88,75.48 33.88,74.73 SD.23
SDA  (via drill 0.3, 0.35)
  Top 0.152: v13.87,60.05 13.87,56.21 16.99,53.09 v16.99,28.19 16.99,12.12 v16.46,11.58 16.42,11.62 v14.9,11.62 | v34.85,10.34 33.1,8.59 v24.38,8.59 | v41.38,28.09 37.85,24.56 37.85,20.75 40.08,18.52 v40.08,16.03
  Bottom 0.152: U1.6 23.46,9.85 23.71,9.6 23.71,8.59 | R30.2 40.77,16.96 40.08,16.27 v40.08,16.03 40.08,12.5 38.43,10.85 U3.5 35.36,10.85 v34.85,10.34 | IC2.56 13.77,59.95 v13.87,60.05 | 23.71,8.59 23.71,8.17 23.41,7.87 18.37,7.87 16.46,9.79 v16.46,11.58 | v24.38,8.59 23.71,8.59 | IC3.3 12.86,14.02 14.9,11.98 v14.9,11.62 | U$6.SDA 39.38,30.74 39.55,30.91 40.89,30.91 41.38,30.43 v41.38,28.09 | J1.22 13.58,26.99 14.73,28.14 16.94,28.14 v16.99,28.19
SPI_MI
  Bottom 0.152: U$2.SO 12.39,49.72 11.27,49.72 9.92,51.07 IC2.42
SPI_MO
  Bottom 0.152: U$2.SI 17.15,52.25 12.67,56.72 IC2.37
SPI_SCK
  Bottom 0.152: U$2.SCK 17.24,50.99 11.57,56.66 IC2.39
SS
  Bottom 0.152: C13.2 24.12,29.08 25.68,29.08 26.33,28.44 IC1.7
SST_CS
  Bottom 0.152: U$2.CE 13.92,48.44 14.71,49.23 14.71,52.79 11.02,56.48 IC2.40
SST_HOLD
  Bottom 0.152: U$2.HOLD 19.13,49.71 21.64,49.71 22.18,50.25 22.18,52.14 20.52,53.8 16.41,53.8 13.22,56.99 IC2.36
SST_WP
  Bottom 0.152: IC2.41 10.47,51.71 11.2,50.98 U$2.WP
SWDCLK
  Bottom 0.152: IC2.43 9.24,57.42 9.24,49.2 6.48,46.43 6.48,28.8 7.26,28.02 11.4,28.02 J1.21
SWDIO
  Bottom 0.152: IC2.44 8.82,49.38 5.92,46.48 5.92,23.85 9.38,20.39 J1.28
SWON  (via drill 0.35)
  Top 0.229: v34.21,14.12 34.21,22.98 38.05,26.81 v38.05,28.37
  Bottom 0.229: M2.1 37.65,33.05 R3.1 38.08,31.12 U$6.IO 38.05,29.66 v38.05,28.37 | D1.2 33.88,5.51 33.88,6.35 34.32,6.78 34.32,9.42 34.21,9.52 v34.21,14.12
USB_D0_N
  Bottom 0.305: R2.2 arc-90 42.38,48.74 41.43,48.74 arc-90 40.39,49.78 arc90 38.89,51.28 29.11,51.28 arc-90 27.17,53.22 arc90 21.49,58.9 18.6,58.9 18.3,59.2 IC2.67
USB_D0_P
  Bottom 0.305: R1.2 arc90 42.33,48.29 41.43,48.29 arc-90 39.93,49.78 arc90 38.89,50.83 33.76,50.83 33.38,50.83 29.11,50.83 arc-90 26.67,53.27 arc90 21.49,58.45 18.67,58.45 18.32,58.1 IC2.68
USB_D1_N
  Bottom 0.305: U$3.2 43.57,49 arc-90 R2.1
USB_D1_P
  Bottom 0.305: U$3.3 44.29,48.35 43.98,48.04 R1.1
VBAT  (via drill 0.3, 0.35)
  Top 0.229: v34.19,35.48 34.19,28.75 35.41,27.53 v35.41,25.91
  Top 0.381: v42.7,22.23 38.76,22.23 v38.38,22.61
  Bottom 0.229: U$5.P$14 29.38,45.54 30.45,45.54 32.23,43.76 32.23,37.44 v34.19,35.48 34.95,36.25 37.62,36.25 38.1,35.76 38.1,34.62 37.64,34.16 36.5,34.16 36.15,33.82 M2.2 35.95,33.05 R3.2 | v35.41,25.91 35.9,25.41 35.9,24.2 34.58,24.2 M1.3 | BATT.2 37.2,25.49 U$6.VIN | U$6.VCC 38.73,23.93 C14.1
  Bottom 0.305: v38.38,22.61 38.13,22.86 38.13,23.33 C14.1
  Bottom 0.381: U2.3 45.68,22.53 | 45.68,22.53 C16.2 | 45.68,22.53 44.27,22.53 43.97,22.23 v42.7,22.23 | 35.9,24.2 BATT.2
  pour Bottom (no thermals): 33.4,23.5 37.49,23.5 37.87,23.11 38.89,23.11 38.89,26.04 36.6,26.04 35.71,25.15 33.4,25.15
VCC  (via drill 0.3, 0.35)
  Top 0.229: v48.41,61.57 41.48,61.57 37.57,65.48 27.33,65.48 26.31,64.47 20.04,64.47 v19.25,65.25 | 27.91,43.7 v28.09,43.7 27.66,43.7 | v22.89,22.48 22.66,22.25 v22.66,17.42 23.88,16.21 25.35,16.21 26.52,15.04 v27.28,15.04 | v37.44,18.69 37.44,16.99 v36.6,16.15
  Top 0.406: v28.09,43.7 22.36,43.7 20.45,45.62 v19.76,45.62 | 27.91,43.7 26.47,45.15 26.47,59.31 24.54,61.24 v19.74,61.24 | 27.66,43.7 27.2,43.25 27.2,33.66 27.66,33.2 v27.66,31.93 27.66,29.54 v24.16,26.04
  Bottom 0.203: 27.01,43.7 C36.2
  Bottom 0.229: 19.69,44.25 R17.1 | R17.1 19.79,44.46 | U$2.VDD 19.19,48.48 19.13,48.54 | 22.01,48.54 C18.1 | v22.89,22.48 23.27,22.86 C12.2 23.39,22.86 v22.89,23.37 | IC1.4 26.33,25.26 26.14,25.07 24.97,25.07 24.16,25.88 v24.16,26.04 24.67,26.55 IC1.5 | v19.25,65.25 IC2.17 | v19.74,61.24 18.13,61.24 IC2.65 | C10.1 10.6,16.34 | 10.6,11.38 C17.1 | IC3.6 10.6,14.02 | IC3.2 10.6,13.36 | IC3.8 10.59,12.72 10.6,12.7 | v48.41,61.57 48.75,61.91 R19.2 48.69,63.56 Q2.1 48.69,65.68 48.21,66.17 46.66,66.17 46.05,66.78 46.05,67.87 44.98,68.94 44.98,72.62 44.13,73.47 C1.2 43.41,74.66 43.4,74.67 43.4,75.16 42.46,76.1 35.51,76.1 35.02,75.61 SD.24 | C37.2 22.73,16.21 C8.1 | U1.14 22.45,15.71 C8.1 | U1.1 25.11,13.96 26.2,15.04 C9.1 27.23,15.09 v27.28,15.04 34.52,15.04 34.9,14.66 U3.8 36.6,14.68 v36.6,16.15 | C44.2 22.72,24.77 v23.14,24.77 | 12.93,24.73 12.87,24.79 | C8.1 22.84,17.24 v22.66,17.42 | v37.44,18.69 37.48,18.73 R31.1 40.69,18.73 R30.1 | v19.76,45.62 19.76,44.54 R17.1
  Bottom 0.406: U$5.P$15 v28.09,43.7 27.01,43.7 | 19.79,44.46 19.79,47.35 v20.98,48.54 | v20.98,48.54 19.13,48.54 | v20.98,48.54 22.01,48.54 | 10.6,16.34 10.6,14.02 10.6,13.36 10.6,12.7 10.6,11.38 | R12.1 28.31,31.28 v27.66,31.93 | J1.24 12.87,24.79 14.73,26.65 22.53,26.65 v23.14,26.04 | C10.1 11.39,16.62 12.93,18.16 12.93,24.73
  other vias: 24.16,24.77
  pour Bottom (rank 2, no thermals): 22.99,21.77 22.3,22.45 22.3,25.55 22.3,26.37 22.53,26.59 26.19,26.59 26.21,26.57 26.42,26.37 26.42,26.06 26.42,24.89 26.31,24.79 25.17,24.79 24.97,24.59 24.97,22.12 24.56,21.72 23.04,21.72 23.01,21.74
  pour Top (rank 2, no thermals): 28.65,60.91 28.65,63.6 26.62,65.63 18.87,65.63 18.87,60.91
VIN  (via drill 0.3, 0.35)
  Top 0.152: v28.17,33.88 28.22,33.88
  Top 0.305: v30.86,26.19 30.15,26.9 30.15,28.04 29.11,29.08 v28.47,29.08 28.4,29.16 28.4,33.71 28.22,33.88
  Bottom 0.152: D3.3 32.05,26.66 | M1.2 32.18,24.38
  Bottom 0.305: IC1.10 27.83,28.82 28.09,29.08 v28.47,29.08 | 32.05,26.66 31.57,26.19 v30.86,26.19 30.86,25.69 32.18,24.38 31.07,24.38 C11.2 | U4.5 18.57,32.61 19.02,33.07 C2.2 21.28,34.71 21.72,35.15 26.9,35.15 v28.17,33.88
  pour Bottom (rank 2, no thermals): 28.73,27.43 32.97,27.43 32.97,23.5 31.37,23.5 30.91,23.04 30.91,22.71 30.89,22.73 29.54,22.73 29.49,22.78 29.49,26.16 29.36,26.29 27.97,26.29 27.84,26.42 27.84,26.54
VUSB  (via drill 0.3, 0.35)
  Top 0.305: v35,28.93 34.9,29.03 34.9,41.83 34.32,42.42 34.32,52.45 v33.68,53.09
  Top 0.381: v36.99,26.94 v35,28.93
  Top 0.508: v42.44,53.09 42.42,53.06 v38.68,53.06
  Bottom 0.229: v35,28.93 35,28.63 34.3,27.93 D3.1 33.22,26.9 33.22,24.1 33.19,24.06 33.19,23.53 32.7,23.05 M1.1 | 44.87,55.62 C21.1 44.77,54.75 | C19.1 44.87,59.87 R4.1
  Bottom 0.305: U$3.1 47.79,49.66 46.2,49.66 42.77,53.09 v42.44,53.09
  Bottom 0.381: U2.4 44.24,26.45 C15.2 42.44,26.35 41.85,26.94 v36.99,26.94 | v33.68,53.09 32.39,53.09 25.17,60.3 IC2.66
  Bottom 0.508: v38.68,53.06 33.71,53.06 v33.68,53.09 | C19.1 44.87,55.62 | 44.77,54.75 43.1,53.09 v42.44,53.09
XL1
  Bottom 0.152: C33.2 24.16,68.87 22.15,68.87 Y3.P$1 17.4,68.88 arc90 IC2.13
XL2
  Bottom 0.152: C32.2 24.29,66.52 22.3,66.52 Y3.P$2 21.38,66.98 21.16,66.98 arc90 21.11,67.03 15.93,67.03 arc90 15.39,66.5 15.39,65.48 arc90 IC2.14